# EAGLE schematic foxBMS_BMS-Slave_12cell (EAGLE 6.5.0), part 3 of 3
## Sheet 16 of 17: Ext. Power Supply
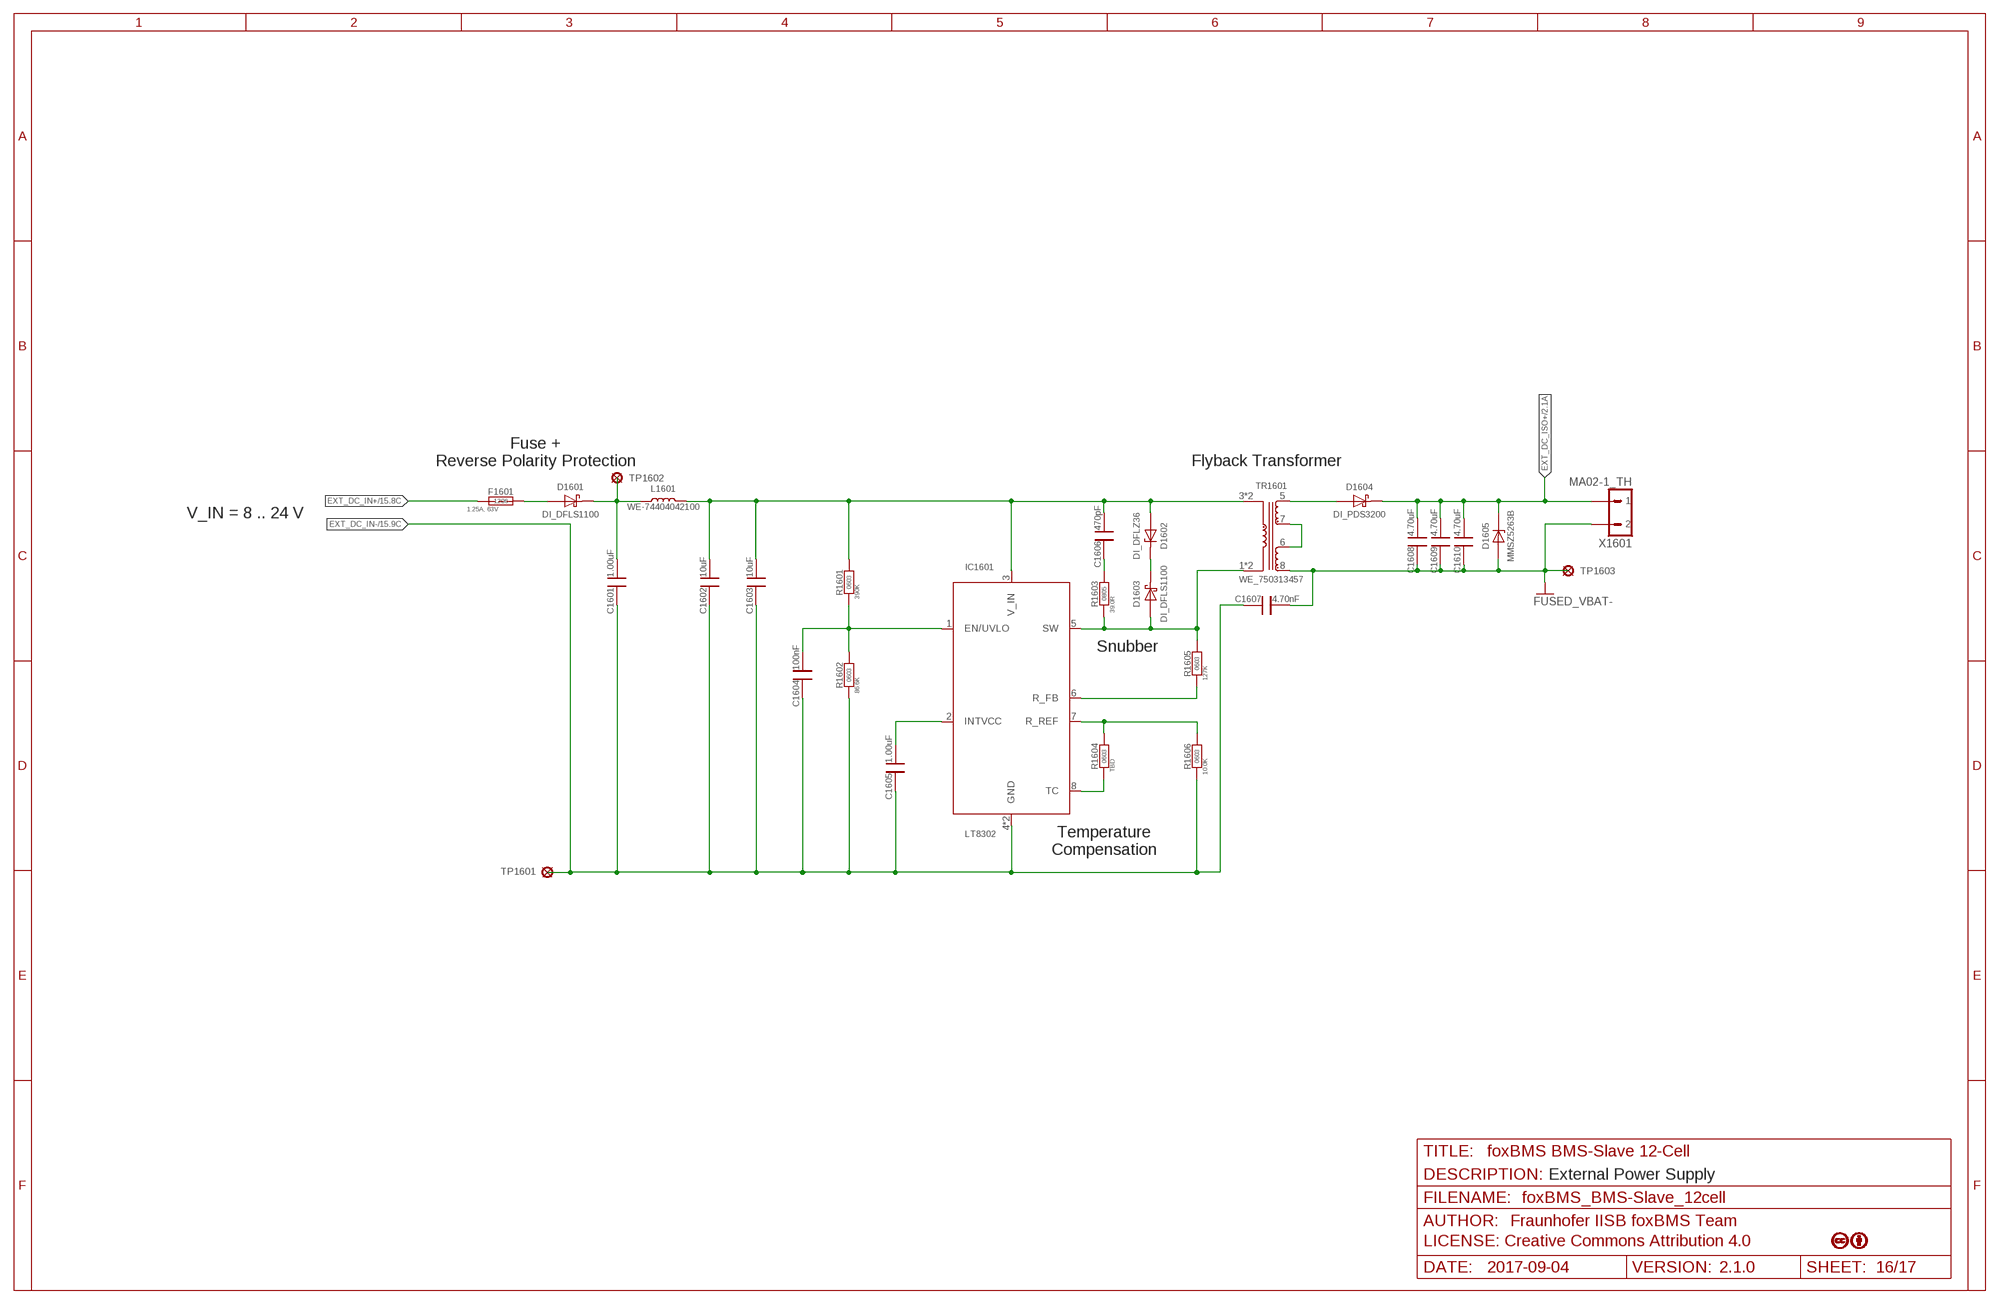
[diagram p22: schematic, sheet 16]

### Parts
C1601  1,00µF_0805_25V_X7R_KEMET  [C_SMD_0805_(2012)_R_KEMET_REV01]
C1602  10µF_1210_25V_X7R  [1210]
C1603  10µF_1210_25V_X7R  [1210]
C1604  100nF, 20%, 16V  100NF_0603_16V_X7R_KEMET  [C_SMD_0603_(1608)_R_KEMET_REV01]
C1605  1uF, 20%, 16V  1,00µF_0603_16V_X7R_KEMET  [C_SMD_0603_(1608)_R_KEMET_REV01]
C1606  470PF_0805_50V_X7R_KEMET  [C_SMD_0805_(2012)_R_KEMET_REV01]
C1607  4,7NF_1812  [1812]
C1608  4,70µF_1206_25V_X7R_KEMET  [C_SMD_1206_(3216)_R_KEMET_REV01]
C1609  4,70µF_1206_25V_X7R_KEMET  [C_SMD_1206_(3216)_R_KEMET_REV01]
C1610  4,70µF_1206_25V_X7R_KEMET  [C_SMD_1206_(3216)_R_KEMET_REV01]
D1601  DI_DFLS1100  [POWER_DI_123]
D1602  DI_DFLZ36  [POWER_DI_123]  (not fitted in variant foxBMS_Standard)  (not fitted in variant foxBMS_Debug)  (not fitted in variant foxBMS_DC-DC-only)
D1603  DI_DFLS1100  [POWER_DI_123]  (not fitted in variant foxBMS_Standard)  (not fitted in variant foxBMS_Debug)  (not fitted in variant foxBMS_DC-DC-only)
D1604  DI_PDS3200  [POWER_DI_5]
D1605  MMSZ5263B  MMSZ524CBT1  [SOD123]
F1601  1,250A_LITTELFUSE_466_1206  [R_SMD_CHIP_1206_R_LITTLEFUSE_REV_01]
IC1601  LT8302  [S8E]
L1601  WE-74404042100  [WE-LQS]
R1601  390K_0603_R_VISHAY_1%_TK100_REV_01  [R_SMD_0603_R_VISHAY_REV01]
R1602  86,6K_0603_R_VISHAY_1%_TK100_REV_01  [R_SMD_0603_R_VISHAY_REV01]
R1603  39,0R_0805_R_VISHAY_1%_TK100_REV_01  [R_SMD_0805_R_VISHAY_REV01]
R1604  DUMMY_R_CHIP_0603_R_VISHAY  [R_SMD_0603_R_VISHAY_REV01]  (not fitted in variant foxBMS_Standard)
R1605  127K_0603_R_VISHAY_1%_TK100_REV_01  [R_SMD_0603_R_VISHAY_REV01]
R1606  10,0K_0603_R_VISHAY_1%_TK100_REV_01  [R_SMD_0603_R_VISHAY_REV01]
TP1601  CUSTOM_PAD_PAD_2.0X1.5MM  [CUSTOM_PAD_PAD2.0X1.5MM]  (not fitted in variant foxBMS_Debug)  (not fitted in variant foxBMS_DC-DC-only)  (not fitted in variant foxBMS_Standard)
TP1602  CUSTOM_PAD_PAD_2.0X1.5MM  [CUSTOM_PAD_PAD2.0X1.5MM]  (not fitted in variant foxBMS_Debug)  (not fitted in variant foxBMS_DC-DC-only)  (not fitted in variant foxBMS_Standard)
TP1603  CUSTOM_PAD_PAD_2.0X1.5MM  [CUSTOM_PAD_PAD2.0X1.5MM]  (not fitted in variant foxBMS_Debug)  (not fitted in variant foxBMS_DC-DC-only)  (not fitted in variant foxBMS_Standard)
TR1601  WE_750313457  [WUERTH_CUSTOM]
X1601  MA02-1_TH  [MA02-1A]  (not fitted in variant foxBMS_Standard)  (not fitted in variant foxBMS_Debug)

### Nets
EXT_DC_IN+: F1601.P$1 ; also sheet 15
EXT_DC_IN-: C1601.P$1 C1602.P$1 C1603.P$1 C1604.1 C1605.1 C1607.P$1 IC1601.4(GND) IC1601.P$1(GND) R1602.1 R1606.1 TP1601.P$1(MP) ; also sheet 15
EXT_DC_ISO+: C1608.P$2 C1609.P$2 C1610.P$2 D1604.K(C) D1605.C(K) X1601.1 ; also sheet 2,3
FUSED_VBAT-: C1607.P$2 C1608.P$1 C1609.P$1 C1610.P$1 D1605.A TP1603.P$1(MP) TR1601.8(PIN8) X1601.2 ; also sheet 2,3,4,5,6,8,9,10,11,12,13,14,15
N$68: C1604.2 IC1601.1(EN/UVLO) R1601.1 R1602.2
N$71: C1605.2 IC1601.2(INTVCC)
N$74: TR1601.6(PIN6) TR1601.7(PIN7)
N$77: IC1601.7(R_REF) R1604.2 R1606.2
N$79: IC1601.6(R_FB) R1605.1
N$80: D1603.A IC1601.5(SW) R1603.1 R1605.2 TR1601.1(PIN2) TR1601.2(PIN2)
N$82: IC1601.8(TC) R1604.1
N$84: D1604.A1(A) D1604.A2(A) TR1601.5(PIN5)
N$87: C1606.P$1 R1603.2
N$89: D1601.A F1601.P$2
N$91: C1601.P$2 D1601.K(C) L1601.1 TP1602.P$1(MP)
N$92: D1602.K(C) D1603.K(C)
N$1254: C1602.P$2 C1603.P$2 C1606.P$2 D1602.A IC1601.3(V_IN) L1601.2 R1601.2 TR1601.3(PIN4) TR1601.4(PIN4)

### Notes on the sheet
- Fuse +
  Reverse Polarity Protection
- Flyback Transformer
- V_IN = 8 .. 24 V
- Snubber
- Temperature
  Compensation
- External Power Supply

## Sheet 17 of 17
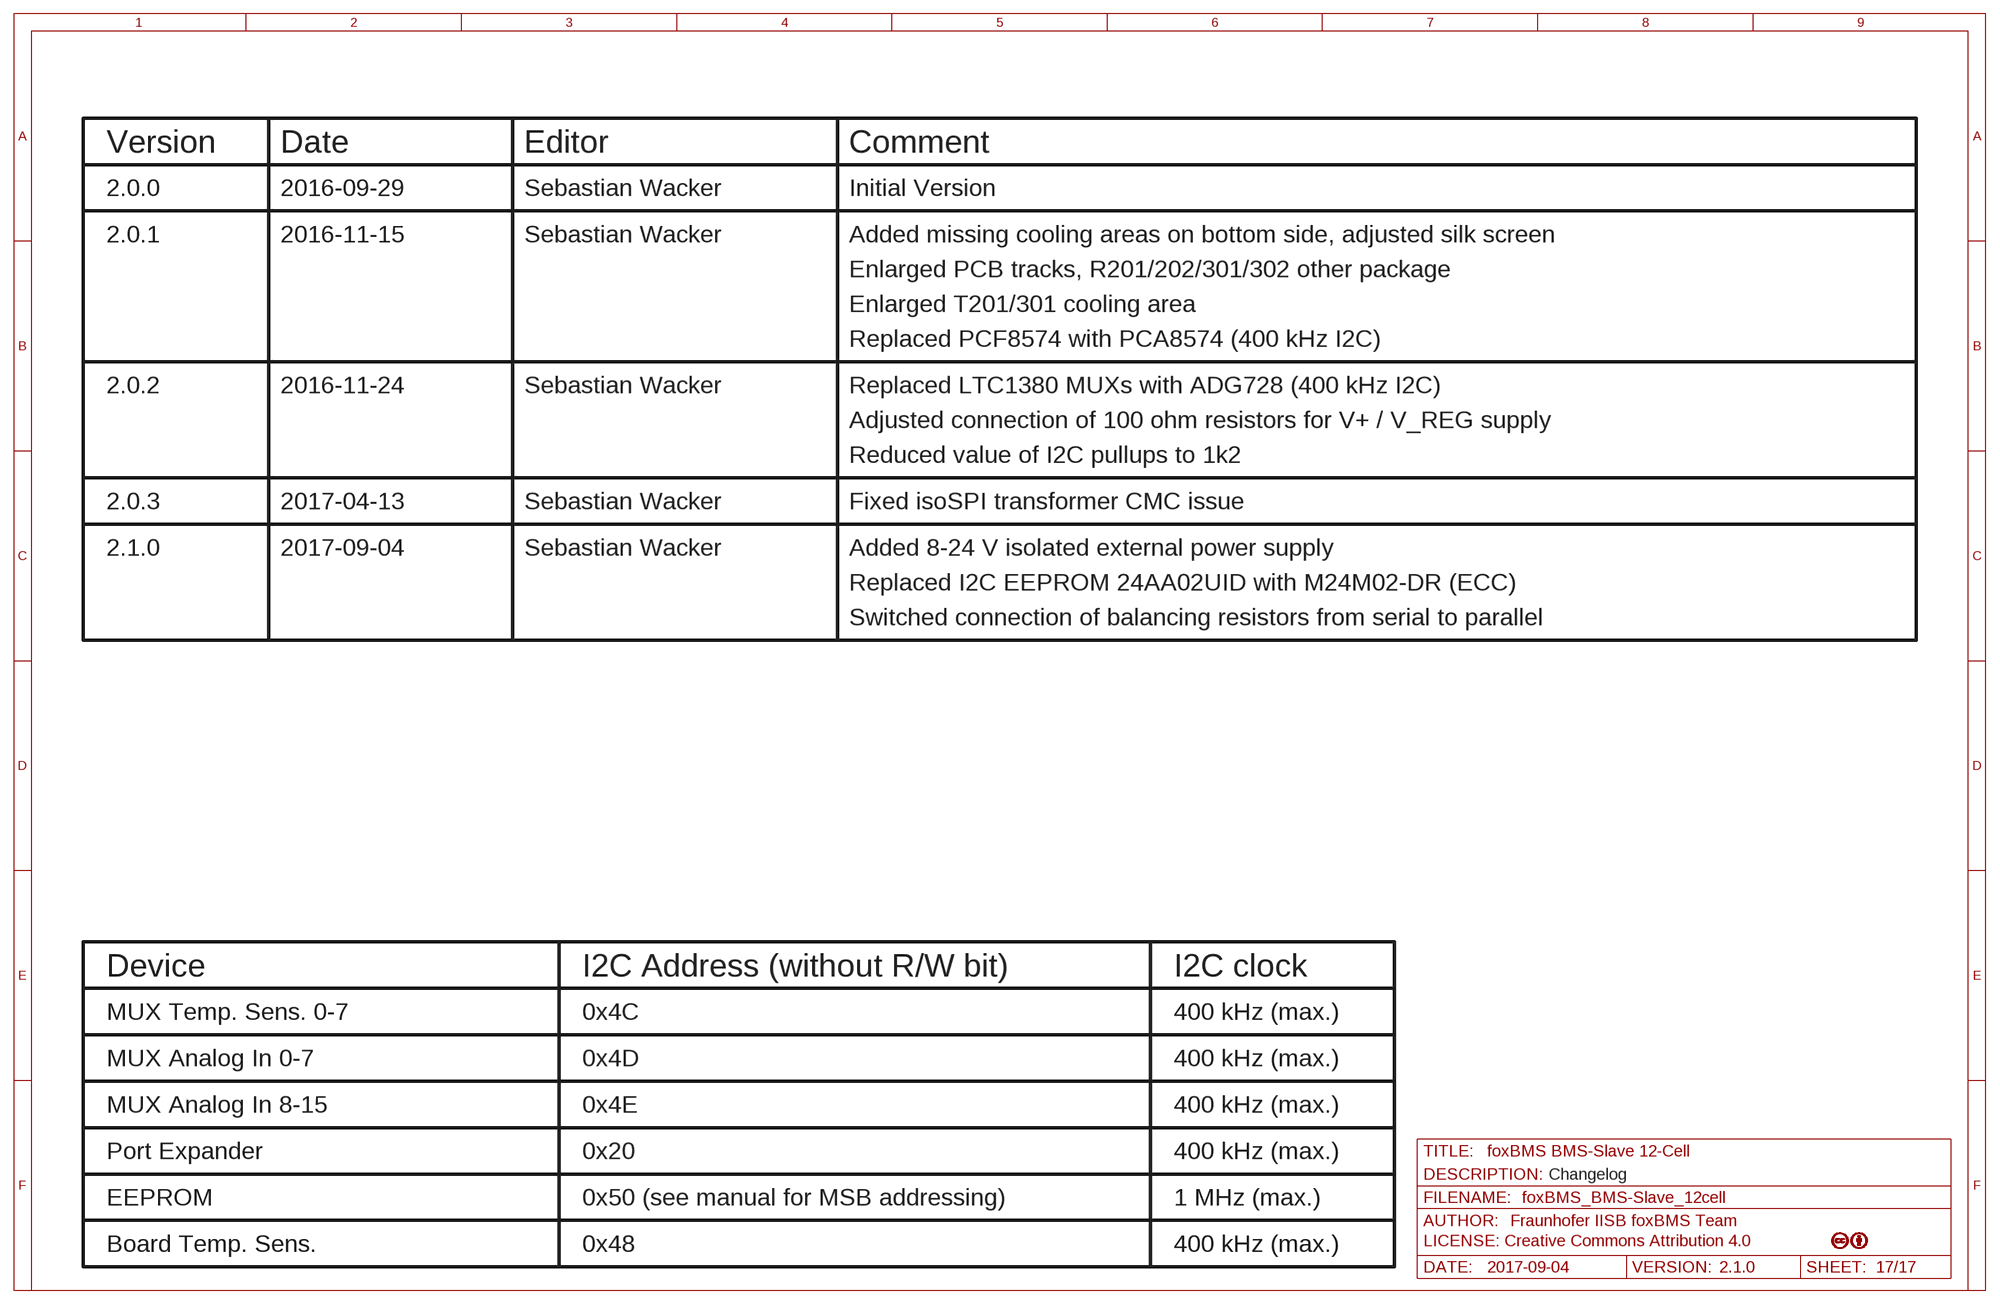
[diagram p23: schematic, sheet 17]

### Notes on the sheet
- Version | Date | Editor | Comment
- 2.0.0 | 2016-09-29 | Sebastian Wacker | Initial Version
- 2.0.1 | 2016-11-15 | Sebastian Wacker | Added missing cooling areas on bottom side, adjusted silk screen
- Enlarged PCB tracks, R201/202/301/302 other package
- Enlarged T201/301 cooling area
- Replaced PCF8574 with PCA8574 (400 kHz I2C)
- 2.0.2 | 2016-11-24 | Sebastian Wacker | Replaced LTC1380 MUXs with ADG728 (400 kHz I2C)
- Adjusted connection of 100 ohm resistors for V+ / V_REG supply
- Reduced value of I2C pullups to 1k2
- 2.0.3 | 2017-04-13 | Sebastian Wacker | Fixed isoSPI transformer CMC issue
- 2.1.0 | 2017-09-04 | Sebastian Wacker | Added 8-24 V isolated external power supply
- Replaced I2C EEPROM 24AA02UID with M24M02-DR (ECC)
- Switched connection of balancing resistors from serial to parallel
- Device | I2C Address (without R/W bit) | I2C clock
- MUX Temp. Sens. 0-7 | 0x4C | 400 kHz (max.)
- MUX Analog In 0-7 | 0x4D | 400 kHz (max.)
- MUX Analog In 8-15 | 0x4E | 400 kHz (max.)
- Port Expander | 0x20 | 400 kHz (max.)
- Changelog
- EEPROM | 0x50 (see manual for MSB addressing) | 1 MHz (max.)
- Board Temp. Sens. | 0x48 | 400 kHz (max.)

## Library data of the parts
C201 C202 C301 C302 = foxBMS_BMS-Slave_12cell:100NF?: 100nF Keramik-Kondensator KEMET-Keramikkondensator: Datasheet www <https://www.buerklin.com/datenblaetter/D104520_TD.pdf?ch=72100> Datasheet local <file:///C:\Eagle-Datasheet\Kapazitaeten\MLCC_Kemet.pdf> Multicomp-Keramikkondensator: Datasheet www <http://www.farnell.com/datasheets/1723208.pdf> Datasheet local <file:///C:\Eagle-Datasheet\Kapazitaeten\MLCC_Multicomp.pdf> MURATA-Keramikkondensator: Datasheet www <http://www.murata.com/~/media/webrenewal/support/library/catalog/products/capacitor/mlcc/c02e.ashx> Datasheet local <file:///C:\Eagle-Datasheet\Kapazitaeten\MLCC_Murata.pdf> TAIYO YUDEN-Keramikkondensator: Datasheet www <http://www.yuden.co.jp/productdata/catalog/en/mlcc01_hq_e.pdf> Datasheet local <file:///C:\Eagle-Datasheet\Kapazitaeten\MLCC_TAIYO_YUDEN.pdf> MLCC - Keramikkondensator Revision Date changed by Changes ------------------------------------------------------------------------------------------ V1.0 06.11.2014 SC Ersterstellung; DISTRI_1: Farnell; DISTRI_1-NR: 2320821; DISTRI_1-PREIS: 0,0101; HERSTELLER: MULTICOMP; HERSTELLER-NR: MC0805B104K101CT; MARKING: -; PDF-LOCAL: file:///C:\Eagle-Datasheet\Kapazitaeten\MLCC_Multicomp.pdf; SIZE: 0805; UKAT: C; UMAT: X7R; UTERM: Sn; UTK: 30PPM/°C; UTMAX: 125°C; UTMIN: -55°C; UTOL: 10%; UTYP: MLCC; UVAL: 100nF; UVDC: 100V; UVF: 0,10%
C203 C205 C206 C303 C305 C306 C902 C903 C906-C908 C1002 C1003 C1006-C1008 C1605 = foxBMS_BMS-Slave_12cell:1,00µF?: 1,00µF Keramik-Kondensator KEMET-Keramikkondensator: Datasheet www <https://www.buerklin.com/datenblaetter/D104520_TD.pdf?ch=72100> Datasheet local <file:///C:\Eagle-Datasheet\Kapazitaeten\MLCC_Kemet.pdf> Multicomp-Keramikkondensator: Datasheet www <http://www.farnell.com/datasheets/1723208.pdf> Datasheet local <file:///C:\Eagle-Datasheet\Kapazitaeten\MLCC_Multicomp.pdf> MURATA-Keramikkondensator: Datasheet www <http://www.murata.com/~/media/webrenewal/support/library/catalog/products/capacitor/mlcc/c02e.ashx> Datasheet local <file:///C:\Eagle-Datasheet\Kapazitaeten\MLCC_Murata.pdf> TAIYO YUDEN-Keramikkondensator: Datasheet www <http://www.yuden.co.jp/productdata/catalog/en/mlcc01_hq_e.pdf> Datasheet local <file:///C:\Eagle-Datasheet\Kapazitaeten\MLCC_TAIYO_YUDEN.pdf> MLCC - Keramikkondensator Revision Date changed by Changes ------------------------------------------------------------------------------------------ V1.0 06.11.2014 SC Ersterstellung; DISTRI_1: Farnell; DISTRI_1-NR: 1650837; DISTRI_1-PREIS: 0,0219 ; DISTRI_2: Mouser; DISTRI_2-NR: 80-C0603C105K4R; DISTRI_2-PREIS: 0,158; HERSTELLER: Kemet; HERSTELLER-NR: C0603C105K4R; MARKING: -; PDF-LOCAL: file:///C:\Eagle-Datasheet\Kapazitaeten\MLCC_Kemet.pdf; SIZE: 0603; UKAT: C; UMAT: X7R; UTERM: Sn; UTK: 15%; UTMAX: 125°C; UTMIN: -55°C; UTOL: 10%; UTYP: MLCC; UVAL: 1.00uF; UVDC: 16.0V; UVF: 3,5%
C204 C207 C304 C307 = foxBMS_BMS-Slave_12cell:100PF?: 100pF Keramik-Kondensator KEMET-Keramikkondensator: Datasheet www <https://www.buerklin.com/datenblaetter/D104520_TD.pdf?ch=72100> Datasheet local <file:///C:\Eagle-Datasheet\Kapazitaeten\MLCC_Kemet.pdf> Multicomp-Keramikkondensator: Datasheet www <http://www.farnell.com/datasheets/1723208.pdf> Datasheet local <file:///C:\Eagle-Datasheet\Kapazitaeten\MLCC_Multicomp.pdf> MURATA-Keramikkondensator: Datasheet www <http://www.murata.com/~/media/webrenewal/support/library/catalog/products/capacitor/mlcc/c02e.ashx> Datasheet local <file:///C:\Eagle-Datasheet\Kapazitaeten\MLCC_Murata.pdf> TAIYO YUDEN-Keramikkondensator: Datasheet www <http://www.yuden.co.jp/productdata/catalog/en/mlcc01_hq_e.pdf> Datasheet local <file:///C:\Eagle-Datasheet\Kapazitaeten\MLCC_TAIYO_YUDEN.pdf> MLCC - Keramikkondensator Revision Date changed by Changes ------------------------------------------------------------------------------------------ V1.0 06.11.2014 SC Ersterstellung; DISTRI_1: Farnell; DISTRI_1-NR: 1414603; DISTRI_1-PREIS: 0,004 ; DISTRI_2: Mouser; DISTRI_2-NR: 80-C0603C101J5G; DISTRI_2-PREIS: 0,007; HERSTELLER: Kemet; HERSTELLER-NR: C0603C101J5G; MARKING: -; PDF-LOCAL: file:///C:\Eagle-Datasheet\Kapazitaeten\MLCC_Kemet.pdf; SIZE: 0603; UKAT: C; UMAT: C0G; UTERM: Sn; UTK: 30PPM/°C; UTMAX: 125°C; UTMIN: -55°C; UTOL: 5%; UTYP: MLCC; UVAL: 100pF; UVDC: 50.0V; UVF: 0,10%
C501-C524 C601-C624 C904 C905 C1004 C1005 = foxBMS_BMS-Slave_12cell:10,0NF?: 10,0nF Keramik-Kondensator KEMET-Keramikkondensator: Datasheet www <https://www.buerklin.com/datenblaetter/D104520_TD.pdf?ch=72100> Datasheet local <file:///C:\Eagle-Datasheet\Kapazitaeten\MLCC_Kemet.pdf> Multicomp-Keramikkondensator: Datasheet www <http://www.farnell.com/datasheets/1723208.pdf> Datasheet local <file:///C:\Eagle-Datasheet\Kapazitaeten\MLCC_Multicomp.pdf> MURATA-Keramikkondensator: Datasheet www <http://www.murata.com/~/media/webrenewal/support/library/catalog/products/capacitor/mlcc/c02e.ashx> Datasheet local <file:///C:\Eagle-Datasheet\Kapazitaeten\MLCC_Murata.pdf> TAIYO YUDEN-Keramikkondensator: Datasheet www <http://www.yuden.co.jp/productdata/catalog/en/mlcc01_hq_e.pdf> Datasheet local <file:///C:\Eagle-Datasheet\Kapazitaeten\MLCC_TAIYO_YUDEN.pdf> MLCC - Keramikkondensator Revision Date changed by Changes ------------------------------------------------------------------------------------------ V1.0 06.11.2014 SC Ersterstellung; DISTRI_1: Farnell; DISTRI_1-NR: 1865545; DISTRI_1-PREIS: 0,0105; UVAL: 10.0nF
C801 C901 C1001 C1101 C1201 C1301 C1302 C1401 C1402 C1501-C1508 C1604 = foxBMS_BMS-Slave_12cell:100NF?: 100nF Keramik-Kondensator KEMET-Keramikkondensator: Datasheet www <https://www.buerklin.com/datenblaetter/D104520_TD.pdf?ch=72100> Datasheet local <file:///C:\Eagle-Datasheet\Kapazitaeten\MLCC_Kemet.pdf> Multicomp-Keramikkondensator: Datasheet www <http://www.farnell.com/datasheets/1723208.pdf> Datasheet local <file:///C:\Eagle-Datasheet\Kapazitaeten\MLCC_Multicomp.pdf> MURATA-Keramikkondensator: Datasheet www <http://www.murata.com/~/media/webrenewal/support/library/catalog/products/capacitor/mlcc/c02e.ashx> Datasheet local <file:///C:\Eagle-Datasheet\Kapazitaeten\MLCC_Murata.pdf> TAIYO YUDEN-Keramikkondensator: Datasheet www <http://www.yuden.co.jp/productdata/catalog/en/mlcc01_hq_e.pdf> Datasheet local <file:///C:\Eagle-Datasheet\Kapazitaeten\MLCC_TAIYO_YUDEN.pdf> MLCC - Keramikkondensator Revision Date changed by Changes ------------------------------------------------------------------------------------------ V1.0 06.11.2014 SC Ersterstellung; DISTRI_1: Bürklin; DISTRI_1-NR: 53D2068; DISTRI_1-PREIS: 0,03; DISTRI_2: Mouser; DISTRI_2-NR: 80-C0603C104K4R; DISTRI_2-PREIS: 0,007; HERSTELLER: Kemet; HERSTELLER-NR: C0603C104K4R; MARKING: -; PDF-LOCAL: file:///C:\Eagle-Datasheet\Kapazitaeten\MLCC_Kemet.pdf; SIZE: 0603; UKAT: C; UMAT: X7R; UTERM: Sn; UTK: 15%; UTMAX: 125°C; UTMIN: -55°C; UTOL: 10%; UTYP: MLCC; UVAL: 100nF; UVDC: 16.0V; UVF: 3,5%
C1601 = 0_LES_KAPAZITAET.SMD.MLCC:1,00µF?: 1,00µF Keramik-Kondensator KEMET-Keramikkondensator: Datasheet www <https://www.buerklin.com/datenblaetter/D104520_TD.pdf?ch=72100> Datasheet local <file:///C:\Eagle-Datasheet\Kapazitaeten\MLCC_Kemet.pdf> Multicomp-Keramikkondensator: Datasheet www <http://www.farnell.com/datasheets/1723208.pdf> Datasheet local <file:///C:\Eagle-Datasheet\Kapazitaeten\MLCC_Multicomp.pdf> MURATA-Keramikkondensator: Datasheet www <http://www.murata.com/~/media/webrenewal/support/library/catalog/products/capacitor/mlcc/c02e.ashx> Datasheet local <file:///C:\Eagle-Datasheet\Kapazitaeten\MLCC_Murata.pdf> TAIYO YUDEN-Keramikkondensator: Datasheet www <http://www.yuden.co.jp/productdata/catalog/en/mlcc01_hq_e.pdf> Datasheet local <file:///C:\Eagle-Datasheet\Kapazitaeten\MLCC_TAIYO_YUDEN.pdf> MLCC - Keramikkondensator Revision Date changed by Changes ------------------------------------------------------------------------------------------ V1.0 06.11.2014 SC Ersterstellung; DISTRI_1: Bürklin; DISTRI_1-NR: 53D2422; DISTRI_1-PREIS: 0,06€; DISTRI_2: Mouser; DISTRI_2-NR: 80-C0805C105K3R; DISTRI_2-PREIS: 0,058€; HERSTELLER: Kemet; HERSTELLER-NR: C0805C105K3R; MARKING: -; PDF-LOCAL: file:///C:\Eagle-Datasheet\Kapazitaeten\MLCC_Kemet.pdf; SIZE: 0805; UKAT: C; UMAT: X7R; UTERM: Sn; UTK: 15%; UTMAX: 125°C; UTMIN: -55°C; UTOL: 10%; UTYP: MLCC; UVAL: 1.00uF; UVDC: 25.0V; UVF: 3,5%
C1602 C1603 = 0_LES_KAPAZITAET.SMD.MLCC.KEMET:10µF?: 10µF Keramik-Kondensator Data sheet <file:///C:\Eagle-Datasheet\Kondensatoren\MLCC_Kemet.pdf> KEMET-Keramikkondensator; DISTRI_1: Bürklin; DISTRI_1-NR: 53D383; DISTRI_1-PREIS: 0,16€; DISTRI_2: Mouser; DISTRI_2-NR: 80-C1210C106K3R; DISTRI_2-PREIS: 1,16€; HERSTELLER: Kemet; HERSTELLER-NR: C1210C106K3R; TK: 15%; TOLERANCE: 10%; UPACKAGE: 1210; UTOL: X7R; UU: 25V; UVAL: 10uF; WERKSTOFF: MLCC
C1606 = 0_LES_KAPAZITAET.SMD.MLCC:470PF?: 470pF Keramik-Kondensator KEMET-Keramikkondensator: Datasheet www <https://www.buerklin.com/datenblaetter/D104520_TD.pdf?ch=72100> Datasheet local <file:///C:\Eagle-Datasheet\Kapazitaeten\MLCC_Kemet.pdf> Multicomp-Keramikkondensator: Datasheet www <http://www.farnell.com/datasheets/1723208.pdf> Datasheet local <file:///C:\Eagle-Datasheet\Kapazitaeten\MLCC_Multicomp.pdf> MURATA-Keramikkondensator: Datasheet www <http://www.murata.com/~/media/webrenewal/support/library/catalog/products/capacitor/mlcc/c02e.ashx> Datasheet local <file:///C:\Eagle-Datasheet\Kapazitaeten\MLCC_Murata.pdf> TAIYO YUDEN-Keramikkondensator: Datasheet www <http://www.yuden.co.jp/productdata/catalog/en/mlcc01_hq_e.pdf> Datasheet local <file:///C:\Eagle-Datasheet\Kapazitaeten\MLCC_TAIYO_YUDEN.pdf> MLCC - Keramikkondensator Revision Date changed by Changes ------------------------------------------------------------------------------------------ V1.0 06.11.2014 SC Ersterstellung; DISTRI_1: Bürklin; DISTRI_1-NR: 53D284; DISTRI_1-PREIS: 0,05€; DISTRI_2: Mouser; DISTRI_2-NR: 80-C0805C471K5R; DISTRI_2-PREIS: 0,016€; HERSTELLER: Kemet; HERSTELLER-NR: C0805C471K5R; MARKING: -; PDF-LOCAL: file:///C:\Eagle-Datasheet\Kapazitaeten\MLCC_Kemet.pdf; SIZE: 0805; UKAT: C; UMAT: X7R; UTERM: Sn; UTK: 15%; UTMAX: 125°C; UTMIN: -55°C; UTOL: 10%; UTYP: MLCC; UVAL: 470pF; UVDC: 50.0V; UVF: 2,5%
C1607 = 0_LES_KAPAZITAET.SMD.MLCC.KEMET_custom:4,7NF?: 4,7nF Keramik-Kondensator Data sheet <file:///C:\Eagle-Datasheet\Kondensatoren\MLCC_Kemet.pdf> KEMET-Keramikkondensator; UVAL: 4.70nF
C1608-C1610 = 0_LES_KAPAZITAET.SMD.MLCC:4,70µF?: 4,70µF Keramik-Kondensator KEMET-Keramikkondensator: Datasheet www <https://www.buerklin.com/datenblaetter/D104520_TD.pdf?ch=72100> Datasheet local <file:///C:\Eagle-Datasheet\Kapazitaeten\MLCC_Kemet.pdf> Multicomp-Keramikkondensator: Datasheet www <http://www.farnell.com/datasheets/1723208.pdf> Datasheet local <file:///C:\Eagle-Datasheet\Kapazitaeten\MLCC_Multicomp.pdf> MURATA-Keramikkondensator: Datasheet www <http://www.murata.com/~/media/webrenewal/support/library/catalog/products/capacitor/mlcc/c02e.ashx> Datasheet local <file:///C:\Eagle-Datasheet\Kapazitaeten\MLCC_Murata.pdf> TAIYO YUDEN-Keramikkondensator: Datasheet www <http://www.yuden.co.jp/productdata/catalog/en/mlcc01_hq_e.pdf> Datasheet local <file:///C:\Eagle-Datasheet\Kapazitaeten\MLCC_TAIYO_YUDEN.pdf> MLCC - Keramikkondensator Revision Date changed by Changes ------------------------------------------------------------------------------------------ V1.0 06.11.2014 SC Ersterstellung; DISTRI_1: Bürklin; DISTRI_1-NR: 53D3424; DISTRI_1-PREIS: 0,15€; DISTRI_2: Mouser; DISTRI_2-NR: 80-C1206C475K3R; DISTRI_2-PREIS: 0,125€; HERSTELLER: Kemet; HERSTELLER-NR: C1206C475K3R; MARKING: -; PDF-LOCAL: file:///C:\Eagle-Datasheet\Kapazitaeten\MLCC_Kemet.pdf; SIZE: 1210; UKAT: C; UMAT: X7R; UTERM: Sn; UTK: 15%; UTMAX: 125°C; UTMIN: -55°C; UTOL: 10%; UTYP: MLCC; UVAL: 4.70uF; UVDC: 25.0V; UVF: 3,5%
D201 D301 D1601 D1603 = diodes_custom:DI_DFLS1100: Schottky Diode
D202 D302 = foxBMS_BMS-Slave_12cell:SMAJ*CA: SMAJ bi-directional Transient Voltage Suppressors - Vishay Datasheet www <http://www.vishay.com/docs/88390/smaj50a.pdf> Datasheet local <file:///C:\Eagle-Datasheet\TVS\SMAJ_Vishay.pdf> 400 W Transient Voltage Suppressor - Ideal for automated placement - Glass passivated chip junction - Excellent clamping capability - Very fast response time - Low profile package - Low incremental surge resistance Revision Date changed by Changes ------------------------------------------------------------------------------------------ V1.0 01.04.2014 SC Ersterstellung; DISTRI_1: Farnell; DISTRI_1-NR: 1837055; DISTRI_1-PREIS: 0,112 ; HERSTELLER: Vishay; HERSTELLER-NR: SMAJ60CA-E3/61; SIZE: SMA; UTMAX: 150°C; UTMIN: -55°C; UTYP: TVS-Diode; UVAL: SMAJ60CA-E3/61; UVBR: 60V
D801 = foxBMS_BMS-Slave_12cell:BAT54C; DISTRI_1: Farnell; DISTRI_1-NR: 1081192; DISTRI_1-PREIS: (5+) 0,0323; UVAL: BAT54C
D1602 = diodes_custom:DI_DFLZ36: Schottky Diode
D1604 = diodes_custom:DI_PDS3200: Schottky Diode
D1605 = L21596_V1.0:MMSZ524CBT1: ON SEMICONDUCTOR - Zener Voltage Regulators 500 mW SOD?123 Surface Mount
F401 F415 = foxBMS_BMS-Slave_12cell:0,500A_LITTELFUSE_448; DISTRI_1: Farnell; DISTRI_1-NR: 1596919; DISTRI_1-PREIS: 0,758 ; UVAL: 500mA, 125V, 0.380R
F402-F414 = foxBMS_BMS-Slave_12cell:0,250A_LITTELFUSE_466_1206; DISTRI_1: Farnell; DISTRI_1-NR: 9921826; DISTRI_1-PREIS: 0,263 ; UPACKAGE: 1206; UVAL: 250mA, 125V, 0.691R
F1601 = foxBMS_BMS-Slave_12cell:1,250A_LITTELFUSE_466_1206; UPACKAGE: 1206; UTOL: 0.057R; UVAL: 1.25A, 63V
IC201 IC301 = foxBMS_BMS-Slave_12cell:0_LES_BATTERIE-MANAGEMENT.SMD_LTC6804*G-1: LTC6804-01 - Linear Technology Datasheet www <http://cds.linear.com/docs/en/datasheet/680412fb.pdf> Datasheet local <file:///C:\Eagle-Datasheet\Batterie-Management\LTC6804_Linear.pdf> Multicell Battery Monitors - Measures Up to 12 Battery Cells in Series - Stackable Architecture Supports 100s of Cells - Built-In isoSPI? Interface: 1Mbps Isolated Serial Communications Uses a Single Twisted Pair, Up to 100 Meters Low EMI Susceptibility and Emissions - 1.2mV Maximum Total Measurement Error - 290µs to Measure All Cells in a System - Synchronized Voltage and Current Measurement - 16-Bit Delta-Sigma ADC with Frequency Programmable 3rd Order Noise Filter - Engineered for ISO26262 Compliant Systems - Passive Cell Balancing with Programmable Timer - 5 General Purpose Digital I/O or Analog Inputs: Temperature or other Sensor Inputs Configurable as an I2C or SPI Master - 4µA Sleep Mode Supply Current - 48-Lead SSOP Package Revision Date changed by Changes ------------------------------------------------------------------------------------------ V1.0 21.04.2016 SC Ersterstellung; DISTRI_1: Digi-Key; DISTRI_1-NR: LTC6804HG-1#PBF-ND; DISTRI_1-PREIS: 18,84 ; HERSTELLER: Linear Technology; HERSTELLER-NR: LTC6804HG-1#PBF; MARKING: LTC6804G-1; PDF-LOCAL: file:///C:\Eagle-Datasheet\Batterie-Management\AN84924UA_Panasonic.pdf; SIZE: SSOP-48; UKAT: I; UTERM: Sn; UTMAX: 125°C; UTMIN: -40°C; UTYP: Battery-Management IC; UVAL: LTC6804HG-1#PBF; UVCC_MAX: 55,0V; UVCC_MIN: 11,0V
IC801-IC803 = foxBMS_BMS-Slave_12cell:ACPL-247: ACPL-247 - AVAGO Datasheet www <http://docs.avagotech.com/docs/AV02-0752EN> Datasheet local <file:///C:\Eagle-Datasheet\Signaluebertrager\ACPL-247-500E_AVAGO.pdf> DC Input Multi-Channel Half-Pitch Phototransistor Optocoupler - Current transfer ratio (CTR: 50% (min) at IF = 5mA, VCE = 5V) - High input-output isolation voltage (VISO = 3,000VRMS) - Non-saturated Response time (tr: 2µs (typ) at VCC = 10V, IC = 2mA, RL= 100Ohm) - SOIC package - CMR 10kV/µs (typical) - Safety and regulatory approvals - cUL - IEC/EN/DIN EN 60747-5-2 Revision Date changed by Changes ------------------------------------------------------------------------------------------ V1.0 05.01.2016 SC Ersterstellung; DISTRI_1: Farnell; DISTRI_1-NR: 1634758; DISTRI_1-PREIS: 0,70; DISTRI_2: Mouser; DISTRI_2-NR: 630-ACPL-247-500E; DISTRI_2-PREIS: 1,65; HERSTELLER: AVAGO Technologies; HERSTELLER-NR: ACPL-247-500E; MARKING: A247V; PDF-LOCAL: file:///C:\Eagle-Datasheet\Signaluebertrager\ACPL-247-500E_AVAGO.pdf; SIZE: SOIC-16; UIC_MAX: 50,0mA; UIC_MIN: 4,00mA; UIC_TYP: 5,00mA; UIF: 50,0mA; UKAT: I; UPV: 170mW; UTERM: Sn; UTMAX: 110°C; UTMIN: -55°C; UTRF: 2,00us; UTRR: 3,00us; UTYP: Optocoupler; UVAL: ACPL-247-500E; UVF: 1,40V; UVISO: 3,00kV; UVR: 80,0V
IC901 IC902 IC905 IC1001 IC1002 IC1005 = foxBMS_BMS-Slave_12cell:ADG728BRUZ: CMOS, Low-Voltage, 2-Wire Serially-Controlled, Matrix Switches; MPN: ADG728BRUZ; OC_FARNELL: 9604383; OC_NEWARK: 19M0691; PACKAGE: TSSOP-16; SUPPLIER: Analog Devices
IC903 IC904 IC1003 IC1004 = foxBMS_BMS-Slave_12cell:LTC6255*?: LTC6255 Serie - Linear Datasheet www <http://cds.linear.com/docs/en/datasheet/625567fd.pdf> Datasheet local <file:///C:\Eagle-Datasheet\Operationsverstaerker\LTC6255-LTC6256-LTC6257_Linear.pdf> 6.5MHz, 65µA Power Efficient Rail-to-Rail I/O Op Amps - Gain Bandwidth Product: 6.5MHz - 3dB Bandwidth (AV = +1): 4.5MHz - Low Quiescent Current: 65µA - C-Load Op Amp Drives all Capacitive Loads - Offset Voltage: 350µV Maximum - Rail-to-Rail Input and Output - Supply Voltage Range: 1.8V to 5.25V - Input Bias Current: 50nA Maximum - CMRR/PSRR: 100dB/100dB - Shutdown Current: 7µA Maximum - Operating Temperature Range: 40°C to 125°C - Single in 6-Lead TSOT-23, 2mm × 2mm DFN Packages - Dual in 8-Lead MS8, MS10, TSOT-23, 2mm × 2mm DFN, 2mm × 2mm Thin DFN Packages - Quad in MS16 Package Revision Date changed by Changes ------------------------------------------------------------------------------------------ V1.0 21.04.2016 SC Ersterstellung; DISTRI_1: Digi-Key; DISTRI_1-NR: LTC6255CS6#TRMPBFCT-ND; DISTRI_1-PREIS: 2,70; HERSTELLER: Linear Technology; HERSTELLER-NR: LTC6255CS6; MARKING: LTFFT; PDF-LOCAL: file:///C:\Eagle-Datasheet\Operationsverstaerker\LTC6255-LTC6256-LTC6257_Linear.pdf; SIZE: TSOT23-6; UBW: 6,50MHz; UKAT: I; UTERM: Sn; UTMAX: 70°C; UTMIN: 0°C; UTYP: Operational Amplifier; UVAL: LTC6255CS6; UVCC_MAX: 5,25V; UVCC_MIN: 1,80V
IC1101 IC1201 = foxBMS_BMS-Slave_12cell:PCF8574TS/3: IC, I/O EXPANDER, 8BIT, I2C, 20SSOP; DISTRI_1: Farnell; DISTRI_1-NR: 2212107; DISTRI_1-PREIS: 0,482 ; MPN: PCF8574TS/3; OC_FARNELL: 2212107; OC_NEWARK: 55W4335; PACKAGE: 20SSOP; SUPPLIER: NXP
IC1301 IC1401 = eeprom_custom:M24M02-DR: I2C EEPROM with ECC
IC1302 IC1402 = foxBMS_BMS-Slave_12cell:MCP9800A0T-M/OT: Temperature Sensor; DISTRI_1: Farnell; DISTRI_1-NR: 1439485; DISTRI_1-PREIS: 0,852; PACKAGE: SOT-5
IC1601 = linear_custom:LT8302: Flyback DC/DC Controller
L1601 = inductor_custom:WE-74404042100: Power Inductor
LD201 LD301 = foxBMS_BMS-Slave_12cell:LED: LED OSRAM: - CHIPLED LG R971, LG N971, LY N971, LG Q971, LY Q971, LO R971, LY R971 LH N974, LH R974 LS Q976, LO Q976, LY Q976 LO Q996 - Hyper CHIPLED LW Q18S LB Q993, LB Q99A, LB R99A - SideLED LS A670, LO A670, LY A670, LG A670, LP A670 LB A673, LV A673, LT A673, LW A673 LH A674 LY A675 LS A676, LA A676, LO A676, LY A676, LW A676 LS A679, LY A679, LG A679 - Hyper Micro SIDELED® LS Y876, LA Y876, LO Y876, LY Y876 LT Y87S - SmartLED LW L88C, LW L88S LB L89C, LB L89S, LG L890 LS L89K, LO L89K, LY L89K LS L896, LA L896, LO L896, LY L896 - TOPLED LS T670, LO T670, LY T670, LG T670, LP T670 LSG T670, LSP T670, LSY T670, LOP T670, LYG T670 LG T671, LOG T671, LSG T671 LB T673, LV T673, LT T673, LW T673 LH T674 LS T676, LA T676, LO T676, LY T676, LB T676, LH T676, LSB T676, LW T676 LB T67C, LV T67C, LT T67C, LS T67K, LO T67K, LY T67K, LW E67C LS E67B, LA E67B, LO E67B, LY E67B, LB E67C, LV E67C, LT E67C LW T67C LS T679, LY T679, LG T679 LS T770, LO T770, LY T770, LG T770, LP T770 LB T773, LV T773, LT T773, LW T773 LH T774 LS E675, LA E675, LY E675, LS T675 LS T776, LA T776, LO T776, LY T776, LB T776 LHGB T686 LT T68C, LB T68C - Hyper Mini TOPLED® LB M676 - Mini TOPLED Santana® LG M470 LS M47K, LO M47K, LY M47K Source: http://www.osram.convergy.de LUXEON: - LUMILED® LXK2-PW12-R00, LXK2-PW12-S00, LXK2-PW14-U00, LXK2-PW14-V00 LXK2-PM12-R00, LXK2-PM12-S00, LXK2-PM14-U00 LXK2-PE12-Q00, LXK2-PE12-R00, LXK2-PE12-S00, LXK2-PE14-T00, LXK2-PE14-U00 LXK2-PB12-K00, LXK2-PB12-L00, LXK2-PB12-M00, LXK2-PB14-N00, LXK2-PB14-P00, LXK2-PB14-Q00 LXK2-PR12-L00, LXK2-PR12-M00, LXK2-PR14-Q00, LXK2-PR14-R00 LXK2-PD12-Q00, LXK2-PD12-R00, LXK2-PD12-S00 LXK2-PH12-R00, LXK2-PH12-S00 LXK2-PL12-P00, LXK2-PL12-Q00, LXK2-PL12-R00 Source: www.luxeon.com KINGBRIGHT: KA-3528ASYC Source: www.kingbright.com; DISTRI_1: Farnell; DISTRI_1-NR: 2099223; DISTRI_1-PREIS: 0,0547 
R201 R301 = 0_LES_WIDERSTAND.SMD.CHIP.DICKSCHICHT:0,00R?*_REV_01: 0,00R SMD - CHIP - Dickschichtwiderstand Vishay D/CRCW_Vishay_Datasheet <file:///C:\Eagle-Datasheet\Widerstaende\CRCW_Vishay.pdf> Yageo/Phycomp RC0402_Datasheet <file:///C:\Eagle-Datasheet\Widerstaende\RC0402_Yageo-Phycomp.pdf>_____RL0402_Datasheet <file:///C:\Eagle-Datasheet\Widerstaende\RL0402_0603_0805_1206_1210_1218_2010_2512_Yageo-Phycomp.pdf> RC0603_Datasheet <file:///C:\Eagle-Datasheet\Widerstaende\RC0603_Yageo-Phycomp.pdf>_____RL0603_Datasheet <file:///C:\Eagle-Datasheet\Widerstaende\RL0402_0603_0805_1206_1210_1218_2010_2512_Yageo-Phycomp.pdf> RC0805_Datasheet <file:///C:\Eagle-Datasheet\Widerstaende\RC0805_Yageo-Phycomp.pdf>_____RL0805_Datasheet <file:///C:\Eagle-Datasheet\Widerstaende\RL0402_0603_0805_1206_1210_1218_2010_2512_Yageo-Phycomp.pdf> RL0805_High-Power Datasheet <file:///C:\Eagle-Datasheet\Widerstaende\RL0805_1206_High-Power_Yageo-Phycomp.pdf> RC1206_Datasheet <file:///C:\Eagle-Datasheet\Widerstaende\RC1206_Yageo-Phycomp.pdf>_____RL1206_Datasheet <file:///C:\Eagle-Datasheet\Widerstaende\RL0402_0603_0805_1206_1210_1218_2010_2512_Yageo-Phycomp.pdf> RL1206_High-Power Datasheet <file:///C:\Eagle-Datasheet\Widerstaende\RL0805_1206_High-Power_Yageo-Phycomp.pdf> RC1210_Datasheet <file:///C:\Eagle-Datasheet\Widerstaende\RC1210_Yageo-Phycomp.pdf>_____RL1210_Datasheet <file:///C:\Eagle-Datasheet\Widerstaende\RL0402_0603_0805_1206_1210_1218_2010_2512_Yageo-Phycomp.pdf> RC1218_Datasheet <file:///C:\Eagle-Datasheet\Widerstaende\RC1218_Yageo-Phycomp.pdf>_____RL1218_Datasheet <file:///C:\Eagle-Datasheet\Widerstaende\RL0402_0603_0805_1206_1210_1218_2010_2512_Yageo-Phycomp.pdf> RC2010_Datasheet <file:///C:\Eagle-Datasheet\Widerstaende\RC2010_Yageo-Phycomp.pdf>_____RL2010_Datasheet <file:///C:\Eagle-Datasheet\Widerstaende\RL0402_0603_0805_1206_1210_1218_2010_2512_Yageo-Phycomp.pdf> RC2512_Datasheet <file:///C:\Eagle-Datasheet\Widerstaende\RC2512_Yageo-Phycomp.pdf>_____RL2512_Datasheet <file:///C:\Eagle-Datasheet\Widerstaende\RL0402_0603_0805_1206_1210_1218_2010_2512_Yageo-Phycomp.pdf> RC2512_High-Power Datasheet <file:///C:\Eagle-Datasheet\Widerstaende\RC2512_High-Power_Yageo-Phycomp.pdf> Dickschichtwiderstand; DISTRI_1: Farnell; DISTRI_1-NR: 1469846; DISTRI_1-PREIS: 0,018€; DISTRI_2: Mouser; DISTRI_2-NR: 71-CRCW0805-0-E3; DISTRI_2-PREIS: 0,022€ / 100St; HERSTELLER: Vishay; HERSTELLER-NR: CRCW08050000Z0EA; MARKING: -; SIZE: 0805; UKAT: I; UMAT: Met; UPV: 125mW; URISO: >1,00GOhm; UTERM: Sn; UTK: 100PPM/°C; UTMAX: 155°C; UTMIN: -55°C; UTYP: Thickfilm; UVAL: 0.00R; UVDC: 150V; UVISO: 200V
R202 R203 R302 R303 = foxBMS_BMS-Slave_12cell:100R?*_REV_01: 100R SMD - CHIP - Dickschichtwiderstand Vishay D/CRCW_Vishay_Datasheet <file:///C:\Eagle-Datasheet\Widerstaende\CRCW_Vishay.pdf> Yageo/Phycomp RC0402_Datasheet <file:///C:\Eagle-Datasheet\Widerstaende\RC0402_Yageo-Phycomp.pdf>_____RL0402_Datasheet <file:///C:\Eagle-Datasheet\Widerstaende\RL0402_0603_0805_1206_1210_1218_2010_2512_Yageo-Phycomp.pdf> RC0603_Datasheet <file:///C:\Eagle-Datasheet\Widerstaende\RC0603_Yageo-Phycomp.pdf>_____RL0603_Datasheet <file:///C:\Eagle-Datasheet\Widerstaende\RL0402_0603_0805_1206_1210_1218_2010_2512_Yageo-Phycomp.pdf> RC0805_Datasheet <file:///C:\Eagle-Datasheet\Widerstaende\RC0805_Yageo-Phycomp.pdf>_____RL0805_Datasheet <file:///C:\Eagle-Datasheet\Widerstaende\RL0402_0603_0805_1206_1210_1218_2010_2512_Yageo-Phycomp.pdf> RL0805_High-Power Datasheet <file:///C:\Eagle-Datasheet\Widerstaende\RL0805_1206_High-Power_Yageo-Phycomp.pdf> RC1206_Datasheet <file:///C:\Eagle-Datasheet\Widerstaende\RC1206_Yageo-Phycomp.pdf>_____RL1206_Datasheet <file:///C:\Eagle-Datasheet\Widerstaende\RL0402_0603_0805_1206_1210_1218_2010_2512_Yageo-Phycomp.pdf> RL1206_High-Power Datasheet <file:///C:\Eagle-Datasheet\Widerstaende\RL0805_1206_High-Power_Yageo-Phycomp.pdf> RC1210_Datasheet <file:///C:\Eagle-Datasheet\Widerstaende\RC1210_Yageo-Phycomp.pdf>_____RL1210_Datasheet <file:///C:\Eagle-Datasheet\Widerstaende\RL0402_0603_0805_1206_1210_1218_2010_2512_Yageo-Phycomp.pdf> RC1218_Datasheet <file:///C:\Eagle-Datasheet\Widerstaende\RC1218_Yageo-Phycomp.pdf>_____RL1218_Datasheet <file:///C:\Eagle-Datasheet\Widerstaende\RL0402_0603_0805_1206_1210_1218_2010_2512_Yageo-Phycomp.pdf> RC2010_Datasheet <file:///C:\Eagle-Datasheet\Widerstaende\RC2010_Yageo-Phycomp.pdf>_____RL2010_Datasheet <file:///C:\Eagle-Datasheet\Widerstaende\RL0402_0603_0805_1206_1210_1218_2010_2512_Yageo-Phycomp.pdf> RC2512_Datasheet <file:///C:\Eagle-Datasheet\Widerstaende\RC2512_Yageo-Phycomp.pdf>_____RL2512_Datasheet <file:///C:\Eagle-Datasheet\Widerstaende\RL0402_0603_0805_1206_1210_1218_2010_2512_Yageo-Phycomp.pdf> RC2512_High-Power Datasheet <file:///C:\Eagle-Datasheet\Widerstaende\RC2512_High-Power_Yageo-Phycomp.pdf> Dickschichtwiderstand; DISTRI_1: Farnell; DISTRI_1-NR: 1469862; DISTRI_1-PREIS: 0,0242 / 100St; DISTRI_2: Mouser; DISTRI_2-NR: 71-CRCW0805-100-E3; DISTRI_2-PREIS: 0,024 / 100St; HERSTELLER: Vishay; HERSTELLER-NR: CRCW0805100RFKEA; MARKING: 1000; SIZE: 0805; UKAT: I; UMAT: Met; UPV: 125mW; URISO: >1,00GOhm; UTERM: Sn; UTK: 100PPM/°C; UTMAX: 155°C; UTMIN: -55°C; UTOL: 1%; UTYP: Thickfilm; UVAL: 100R; UVDC: 150V; UVISO: 200V
R204 R207 R304 R307 = foxBMS_BMS-Slave_12cell:120R?*_REV_01: 120R SMD - CHIP - Dickschichtwiderstand Vishay D/CRCW_Vishay_Datasheet <file:///C:\Eagle-Datasheet\Widerstaende\CRCW_Vishay.pdf> Yageo/Phycomp RC0402_Datasheet <file:///C:\Eagle-Datasheet\Widerstaende\RC0402_Yageo-Phycomp.pdf>_____RL0402_Datasheet <file:///C:\Eagle-Datasheet\Widerstaende\RL0402_0603_0805_1206_1210_1218_2010_2512_Yageo-Phycomp.pdf> RC0603_Datasheet <file:///C:\Eagle-Datasheet\Widerstaende\RC0603_Yageo-Phycomp.pdf>_____RL0603_Datasheet <file:///C:\Eagle-Datasheet\Widerstaende\RL0402_0603_0805_1206_1210_1218_2010_2512_Yageo-Phycomp.pdf> RC0805_Datasheet <file:///C:\Eagle-Datasheet\Widerstaende\RC0805_Yageo-Phycomp.pdf>_____RL0805_Datasheet <file:///C:\Eagle-Datasheet\Widerstaende\RL0402_0603_0805_1206_1210_1218_2010_2512_Yageo-Phycomp.pdf> RL0805_High-Power Datasheet <file:///C:\Eagle-Datasheet\Widerstaende\RL0805_1206_High-Power_Yageo-Phycomp.pdf> RC1206_Datasheet <file:///C:\Eagle-Datasheet\Widerstaende\RC1206_Yageo-Phycomp.pdf>_____RL1206_Datasheet <file:///C:\Eagle-Datasheet\Widerstaende\RL0402_0603_0805_1206_1210_1218_2010_2512_Yageo-Phycomp.pdf> RL1206_High-Power Datasheet <file:///C:\Eagle-Datasheet\Widerstaende\RL0805_1206_High-Power_Yageo-Phycomp.pdf> RC1210_Datasheet <file:///C:\Eagle-Datasheet\Widerstaende\RC1210_Yageo-Phycomp.pdf>_____RL1210_Datasheet <file:///C:\Eagle-Datasheet\Widerstaende\RL0402_0603_0805_1206_1210_1218_2010_2512_Yageo-Phycomp.pdf> RC1218_Datasheet <file:///C:\Eagle-Datasheet\Widerstaende\RC1218_Yageo-Phycomp.pdf>_____RL1218_Datasheet <file:///C:\Eagle-Datasheet\Widerstaende\RL0402_0603_0805_1206_1210_1218_2010_2512_Yageo-Phycomp.pdf> RC2010_Datasheet <file:///C:\Eagle-Datasheet\Widerstaende\RC2010_Yageo-Phycomp.pdf>_____RL2010_Datasheet <file:///C:\Eagle-Datasheet\Widerstaende\RL0402_0603_0805_1206_1210_1218_2010_2512_Yageo-Phycomp.pdf> RC2512_Datasheet <file:///C:\Eagle-Datasheet\Widerstaende\RC2512_Yageo-Phycomp.pdf>_____RL2512_Datasheet <file:///C:\Eagle-Datasheet\Widerstaende\RL0402_0603_0805_1206_1210_1218_2010_2512_Yageo-Phycomp.pdf> RC2512_High-Power Datasheet <file:///C:\Eagle-Datasheet\Widerstaende\RC2512_High-Power_Yageo-Phycomp.pdf> Dickschichtwiderstand; DISTRI_1: Farnell; DISTRI_1-NR: 1652832; DISTRI_1-PREIS: 0,013 / 100St; DISTRI_2: Mouser; DISTRI_2-NR: 71-CRCW0603-120-E3; DISTRI_2-PREIS: 0,009 / 100St; HERSTELLER: Vishay; HERSTELLER-NR: CRCW0603120RFKEA; MARKING: 1200; SIZE: 0603; UKAT: I; UMAT: Met; UPV: 100mW; URISO: >1,00GOhm; UTERM: Sn; UTK: 100PPM/°C; UTMAX: 155°C; UTMIN: -55°C; UTOL: 1%; UTYP: Thickfilm; UVAL: 120R; UVDC: 75,0V; UVISO: 100V
R205 R305 = 0_LES_WIDERSTAND.SMD.CHIP.DICKSCHICHT:330R?*_REV_01: 330R SMD - CHIP - Dickschichtwiderstand Vishay D/CRCW_Vishay_Datasheet <file:///C:\Eagle-Datasheet\Widerstaende\CRCW_Vishay.pdf> Yageo/Phycomp RC0402_Datasheet <file:///C:\Eagle-Datasheet\Widerstaende\RC0402_Yageo-Phycomp.pdf>_____RL0402_Datasheet <file:///C:\Eagle-Datasheet\Widerstaende\RL0402_0603_0805_1206_1210_1218_2010_2512_Yageo-Phycomp.pdf> RC0603_Datasheet <file:///C:\Eagle-Datasheet\Widerstaende\RC0603_Yageo-Phycomp.pdf>_____RL0603_Datasheet <file:///C:\Eagle-Datasheet\Widerstaende\RL0402_0603_0805_1206_1210_1218_2010_2512_Yageo-Phycomp.pdf> RC0805_Datasheet <file:///C:\Eagle-Datasheet\Widerstaende\RC0805_Yageo-Phycomp.pdf>_____RL0805_Datasheet <file:///C:\Eagle-Datasheet\Widerstaende\RL0402_0603_0805_1206_1210_1218_2010_2512_Yageo-Phycomp.pdf> RL0805_High-Power Datasheet <file:///C:\Eagle-Datasheet\Widerstaende\RL0805_1206_High-Power_Yageo-Phycomp.pdf> RC1206_Datasheet <file:///C:\Eagle-Datasheet\Widerstaende\RC1206_Yageo-Phycomp.pdf>_____RL1206_Datasheet <file:///C:\Eagle-Datasheet\Widerstaende\RL0402_0603_0805_1206_1210_1218_2010_2512_Yageo-Phycomp.pdf> RL1206_High-Power Datasheet <file:///C:\Eagle-Datasheet\Widerstaende\RL0805_1206_High-Power_Yageo-Phycomp.pdf> RC1210_Datasheet <file:///C:\Eagle-Datasheet\Widerstaende\RC1210_Yageo-Phycomp.pdf>_____RL1210_Datasheet <file:///C:\Eagle-Datasheet\Widerstaende\RL0402_0603_0805_1206_1210_1218_2010_2512_Yageo-Phycomp.pdf> RC1218_Datasheet <file:///C:\Eagle-Datasheet\Widerstaende\RC1218_Yageo-Phycomp.pdf>_____RL1218_Datasheet <file:///C:\Eagle-Datasheet\Widerstaende\RL0402_0603_0805_1206_1210_1218_2010_2512_Yageo-Phycomp.pdf> RC2010_Datasheet <file:///C:\Eagle-Datasheet\Widerstaende\RC2010_Yageo-Phycomp.pdf>_____RL2010_Datasheet <file:///C:\Eagle-Datasheet\Widerstaende\RL0402_0603_0805_1206_1210_1218_2010_2512_Yageo-Phycomp.pdf> RC2512_Datasheet <file:///C:\Eagle-Datasheet\Widerstaende\RC2512_Yageo-Phycomp.pdf>_____RL2512_Datasheet <file:///C:\Eagle-Datasheet\Widerstaende\RL0402_0603_0805_1206_1210_1218_2010_2512_Yageo-Phycomp.pdf> RC2512_High-Power Datasheet <file:///C:\Eagle-Datasheet\Widerstaende\RC2512_High-Power_Yageo-Phycomp.pdf> Dickschichtwiderstand; DISTRI_1: Farnell; DISTRI_1-NR: 1469803; DISTRI_1-PREIS: 0,0116€ / 100St; DISTRI_2: Mouser; DISTRI_2-NR: 71-CRCW0603-330-E3; DISTRI_2-PREIS: 0,009€ / 100St; HERSTELLER: Vishay; HERSTELLER-NR: CRCW0603330RFKEA; MARKING: 3300; SIZE: 0603; UKAT: I; UMAT: Met; UPV: 100mW; URISO: >1,00GOhm; UTERM: Sn; UTK: 100PPM/°C; UTMAX: 155°C; UTMIN: -55°C; UTOL: 1%; UTYP: Thickfilm; UVAL: 330R; UVDC: 75,0V; UVISO: 100V
R206 R306 = foxBMS_BMS-Slave_12cell:820R?*_REV_01: 820R SMD - CHIP - Dickschichtwiderstand Vishay D/CRCW_Vishay_Datasheet <file:///C:\Eagle-Datasheet\Widerstaende\CRCW_Vishay.pdf> Yageo/Phycomp RC0402_Datasheet <file:///C:\Eagle-Datasheet\Widerstaende\RC0402_Yageo-Phycomp.pdf>_____RL0402_Datasheet <file:///C:\Eagle-Datasheet\Widerstaende\RL0402_0603_0805_1206_1210_1218_2010_2512_Yageo-Phycomp.pdf> RC0603_Datasheet <file:///C:\Eagle-Datasheet\Widerstaende\RC0603_Yageo-Phycomp.pdf>_____RL0603_Datasheet <file:///C:\Eagle-Datasheet\Widerstaende\RL0402_0603_0805_1206_1210_1218_2010_2512_Yageo-Phycomp.pdf> RC0805_Datasheet <file:///C:\Eagle-Datasheet\Widerstaende\RC0805_Yageo-Phycomp.pdf>_____RL0805_Datasheet <file:///C:\Eagle-Datasheet\Widerstaende\RL0402_0603_0805_1206_1210_1218_2010_2512_Yageo-Phycomp.pdf> RL0805_High-Power Datasheet <file:///C:\Eagle-Datasheet\Widerstaende\RL0805_1206_High-Power_Yageo-Phycomp.pdf> RC1206_Datasheet <file:///C:\Eagle-Datasheet\Widerstaende\RC1206_Yageo-Phycomp.pdf>_____RL1206_Datasheet <file:///C:\Eagle-Datasheet\Widerstaende\RL0402_0603_0805_1206_1210_1218_2010_2512_Yageo-Phycomp.pdf> RL1206_High-Power Datasheet <file:///C:\Eagle-Datasheet\Widerstaende\RL0805_1206_High-Power_Yageo-Phycomp.pdf> RC1210_Datasheet <file:///C:\Eagle-Datasheet\Widerstaende\RC1210_Yageo-Phycomp.pdf>_____RL1210_Datasheet <file:///C:\Eagle-Datasheet\Widerstaende\RL0402_0603_0805_1206_1210_1218_2010_2512_Yageo-Phycomp.pdf> RC1218_Datasheet <file:///C:\Eagle-Datasheet\Widerstaende\RC1218_Yageo-Phycomp.pdf>_____RL1218_Datasheet <file:///C:\Eagle-Datasheet\Widerstaende\RL0402_0603_0805_1206_1210_1218_2010_2512_Yageo-Phycomp.pdf> RC2010_Datasheet <file:///C:\Eagle-Datasheet\Widerstaende\RC2010_Yageo-Phycomp.pdf>_____RL2010_Datasheet <file:///C:\Eagle-Datasheet\Widerstaende\RL0402_0603_0805_1206_1210_1218_2010_2512_Yageo-Phycomp.pdf> RC2512_Datasheet <file:///C:\Eagle-Datasheet\Widerstaende\RC2512_Yageo-Phycomp.pdf>_____RL2512_Datasheet <file:///C:\Eagle-Datasheet\Widerstaende\RL0402_0603_0805_1206_1210_1218_2010_2512_Yageo-Phycomp.pdf> RC2512_High-Power Datasheet <file:///C:\Eagle-Datasheet\Widerstaende\RC2512_High-Power_Yageo-Phycomp.pdf> Dickschichtwiderstand; DISTRI_1: Farnell; DISTRI_1-NR: 1469841; DISTRI_1-PREIS: 0,0095 / 100St; DISTRI_2: Mouser; DISTRI_2-NR: 71-CRCW0603-820-E3; DISTRI_2-PREIS: 0,024 / 100St; HERSTELLER: Vishay; HERSTELLER-NR: CRCW0603820RFKEA; MARKING: 8200; SIZE: 0603; UKAT: I; UMAT: Met; UPV: 100mW; URISO: >1,00GOhm; UTERM: Sn; UTK: 100PPM/°C; UTMAX: 155°C; UTMIN: -55°C; UTOL: 1%; UTYP: Thickfilm; UVAL: 820R; UVDC: 75,0V; UVISO: 100V
R208 R308 = foxBMS_BMS-Slave_12cell:1,21K?*_REV_01: 1,21K SMD - CHIP - Dickschichtwiderstand Vishay D/CRCW_Vishay_Datasheet <file:///C:\Eagle-Datasheet\Widerstaende\CRCW_Vishay.pdf> Yageo/Phycomp RC0402_Datasheet <file:///C:\Eagle-Datasheet\Widerstaende\RC0402_Yageo-Phycomp.pdf>_____RL0402_Datasheet <file:///C:\Eagle-Datasheet\Widerstaende\RL0402_0603_0805_1206_1210_1218_2010_2512_Yageo-Phycomp.pdf> RC0603_Datasheet <file:///C:\Eagle-Datasheet\Widerstaende\RC0603_Yageo-Phycomp.pdf>_____RL0603_Datasheet <file:///C:\Eagle-Datasheet\Widerstaende\RL0402_0603_0805_1206_1210_1218_2010_2512_Yageo-Phycomp.pdf> RC0805_Datasheet <file:///C:\Eagle-Datasheet\Widerstaende\RC0805_Yageo-Phycomp.pdf>_____RL0805_Datasheet <file:///C:\Eagle-Datasheet\Widerstaende\RL0402_0603_0805_1206_1210_1218_2010_2512_Yageo-Phycomp.pdf> RL0805_High-Power Datasheet <file:///C:\Eagle-Datasheet\Widerstaende\RL0805_1206_High-Power_Yageo-Phycomp.pdf> RC1206_Datasheet <file:///C:\Eagle-Datasheet\Widerstaende\RC1206_Yageo-Phycomp.pdf>_____RL1206_Datasheet <file:///C:\Eagle-Datasheet\Widerstaende\RL0402_0603_0805_1206_1210_1218_2010_2512_Yageo-Phycomp.pdf> RL1206_High-Power Datasheet <file:///C:\Eagle-Datasheet\Widerstaende\RL0805_1206_High-Power_Yageo-Phycomp.pdf> RC1210_Datasheet <file:///C:\Eagle-Datasheet\Widerstaende\RC1210_Yageo-Phycomp.pdf>_____RL1210_Datasheet <file:///C:\Eagle-Datasheet\Widerstaende\RL0402_0603_0805_1206_1210_1218_2010_2512_Yageo-Phycomp.pdf> RC1218_Datasheet <file:///C:\Eagle-Datasheet\Widerstaende\RC1218_Yageo-Phycomp.pdf>_____RL1218_Datasheet <file:///C:\Eagle-Datasheet\Widerstaende\RL0402_0603_0805_1206_1210_1218_2010_2512_Yageo-Phycomp.pdf> RC2010_Datasheet <file:///C:\Eagle-Datasheet\Widerstaende\RC2010_Yageo-Phycomp.pdf>_____RL2010_Datasheet <file:///C:\Eagle-Datasheet\Widerstaende\RL0402_0603_0805_1206_1210_1218_2010_2512_Yageo-Phycomp.pdf> RC2512_Datasheet <file:///C:\Eagle-Datasheet\Widerstaende\RC2512_Yageo-Phycomp.pdf>_____RL2512_Datasheet <file:///C:\Eagle-Datasheet\Widerstaende\RL0402_0603_0805_1206_1210_1218_2010_2512_Yageo-Phycomp.pdf> RC2512_High-Power Datasheet <file:///C:\Eagle-Datasheet\Widerstaende\RC2512_High-Power_Yageo-Phycomp.pdf> Dickschichtwiderstand; DISTRI_1: Farnell; DISTRI_1-NR: 1652852; DISTRI_1-PREIS: 0,028; DISTRI_2: Mouser; DISTRI_2-NR: 71-CRCW0603-1.21K-E3; DISTRI_2-PREIS: 0,011 / 100St; HERSTELLER: Vishay; HERSTELLER-NR: CRCW06031K21FKEA; MARKING: 1211; SIZE: 0603; UKAT: I; UMAT: Met; UPV: 100mW; URISO: >1,00GOhm; UTERM: Sn; UTK: 100PPM/°C; UTMAX: 155°C; UTMIN: -55°C; UTOL: 1%; UTYP: Thickfilm; UVAL: 1.21K; UVDC: 75,0V; UVISO: 100V
R209-R218 R220 R221 R309-R318 R320 R321 = foxBMS_BMS-Slave_12cell:0,00R?*_REV_01: 0,00R SMD - CHIP - Dickschichtwiderstand Vishay D/CRCW_Vishay_Datasheet <file:///C:\Eagle-Datasheet\Widerstaende\CRCW_Vishay.pdf> Yageo/Phycomp RC0402_Datasheet <file:///C:\Eagle-Datasheet\Widerstaende\RC0402_Yageo-Phycomp.pdf>_____RL0402_Datasheet <file:///C:\Eagle-Datasheet\Widerstaende\RL0402_0603_0805_1206_1210_1218_2010_2512_Yageo-Phycomp.pdf> RC0603_Datasheet <file:///C:\Eagle-Datasheet\Widerstaende\RC0603_Yageo-Phycomp.pdf>_____RL0603_Datasheet <file:///C:\Eagle-Datasheet\Widerstaende\RL0402_0603_0805_1206_1210_1218_2010_2512_Yageo-Phycomp.pdf> RC0805_Datasheet <file:///C:\Eagle-Datasheet\Widerstaende\RC0805_Yageo-Phycomp.pdf>_____RL0805_Datasheet <file:///C:\Eagle-Datasheet\Widerstaende\RL0402_0603_0805_1206_1210_1218_2010_2512_Yageo-Phycomp.pdf> RL0805_High-Power Datasheet <file:///C:\Eagle-Datasheet\Widerstaende\RL0805_1206_High-Power_Yageo-Phycomp.pdf> RC1206_Datasheet <file:///C:\Eagle-Datasheet\Widerstaende\RC1206_Yageo-Phycomp.pdf>_____RL1206_Datasheet <file:///C:\Eagle-Datasheet\Widerstaende\RL0402_0603_0805_1206_1210_1218_2010_2512_Yageo-Phycomp.pdf> RL1206_High-Power Datasheet <file:///C:\Eagle-Datasheet\Widerstaende\RL0805_1206_High-Power_Yageo-Phycomp.pdf> RC1210_Datasheet <file:///C:\Eagle-Datasheet\Widerstaende\RC1210_Yageo-Phycomp.pdf>_____RL1210_Datasheet <file:///C:\Eagle-Datasheet\Widerstaende\RL0402_0603_0805_1206_1210_1218_2010_2512_Yageo-Phycomp.pdf> RC1218_Datasheet <file:///C:\Eagle-Datasheet\Widerstaende\RC1218_Yageo-Phycomp.pdf>_____RL1218_Datasheet <file:///C:\Eagle-Datasheet\Widerstaende\RL0402_0603_0805_1206_1210_1218_2010_2512_Yageo-Phycomp.pdf> RC2010_Datasheet <file:///C:\Eagle-Datasheet\Widerstaende\RC2010_Yageo-Phycomp.pdf>_____RL2010_Datasheet <file:///C:\Eagle-Datasheet\Widerstaende\RL0402_0603_0805_1206_1210_1218_2010_2512_Yageo-Phycomp.pdf> RC2512_Datasheet <file:///C:\Eagle-Datasheet\Widerstaende\RC2512_Yageo-Phycomp.pdf>_____RL2512_Datasheet <file:///C:\Eagle-Datasheet\Widerstaende\RL0402_0603_0805_1206_1210_1218_2010_2512_Yageo-Phycomp.pdf> RC2512_High-Power Datasheet <file:///C:\Eagle-Datasheet\Widerstaende\RC2512_High-Power_Yageo-Phycomp.pdf> Dickschichtwiderstand; DISTRI_1: Farnell; DISTRI_1-NR: 1469739; DISTRI_1-PREIS: 0,019; DISTRI_2: Mouser; DISTRI_2-NR: 71-CRCW0603-0-E3; DISTRI_2-PREIS: 0,007 / 100St; HERSTELLER: Vishay; HERSTELLER-NR: CRCW06030000Z0EA; MARKING: -; SIZE: 0603; UKAT: I; UMAT: Met; UPV: 100mW; URISO: >1,00GOhm; UTERM: Sn; UTK: 100PPM/°C; UTMAX: 155°C; UTMIN: -55°C; UTYP: Thickfilm; UVAL: 0.00R; UVDC: 75,0V; UVISO: 100V
R219 R319 = foxBMS_BMS-Slave_12cell:1,00M?*_REV_01: 1,00M SMD - CHIP - Dickschichtwiderstand Vishay D/CRCW_Vishay_Datasheet <file:///C:\Eagle-Datasheet\Widerstaende\CRCW_Vishay.pdf> Yageo/Phycomp RC0402_Datasheet <file:///C:\Eagle-Datasheet\Widerstaende\RC0402_Yageo-Phycomp.pdf>_____RL0402_Datasheet <file:///C:\Eagle-Datasheet\Widerstaende\RL0402_0603_0805_1206_1210_1218_2010_2512_Yageo-Phycomp.pdf> RC0603_Datasheet <file:///C:\Eagle-Datasheet\Widerstaende\RC0603_Yageo-Phycomp.pdf>_____RL0603_Datasheet <file:///C:\Eagle-Datasheet\Widerstaende\RL0402_0603_0805_1206_1210_1218_2010_2512_Yageo-Phycomp.pdf> RC0805_Datasheet <file:///C:\Eagle-Datasheet\Widerstaende\RC0805_Yageo-Phycomp.pdf>_____RL0805_Datasheet <file:///C:\Eagle-Datasheet\Widerstaende\RL0402_0603_0805_1206_1210_1218_2010_2512_Yageo-Phycomp.pdf> RL0805_High-Power Datasheet <file:///C:\Eagle-Datasheet\Widerstaende\RL0805_1206_High-Power_Yageo-Phycomp.pdf> RC1206_Datasheet <file:///C:\Eagle-Datasheet\Widerstaende\RC1206_Yageo-Phycomp.pdf>_____RL1206_Datasheet <file:///C:\Eagle-Datasheet\Widerstaende\RL0402_0603_0805_1206_1210_1218_2010_2512_Yageo-Phycomp.pdf> RL1206_High-Power Datasheet <file:///C:\Eagle-Datasheet\Widerstaende\RL0805_1206_High-Power_Yageo-Phycomp.pdf> RC1210_Datasheet <file:///C:\Eagle-Datasheet\Widerstaende\RC1210_Yageo-Phycomp.pdf>_____RL1210_Datasheet <file:///C:\Eagle-Datasheet\Widerstaende\RL0402_0603_0805_1206_1210_1218_2010_2512_Yageo-Phycomp.pdf> RC1218_Datasheet <file:///C:\Eagle-Datasheet\Widerstaende\RC1218_Yageo-Phycomp.pdf>_____RL1218_Datasheet <file:///C:\Eagle-Datasheet\Widerstaende\RL0402_0603_0805_1206_1210_1218_2010_2512_Yageo-Phycomp.pdf> RC2010_Datasheet <file:///C:\Eagle-Datasheet\Widerstaende\RC2010_Yageo-Phycomp.pdf>_____RL2010_Datasheet <file:///C:\Eagle-Datasheet\Widerstaende\RL0402_0603_0805_1206_1210_1218_2010_2512_Yageo-Phycomp.pdf> RC2512_Datasheet <file:///C:\Eagle-Datasheet\Widerstaende\RC2512_Yageo-Phycomp.pdf>_____RL2512_Datasheet <file:///C:\Eagle-Datasheet\Widerstaende\RL0402_0603_0805_1206_1210_1218_2010_2512_Yageo-Phycomp.pdf> RC2512_High-Power Datasheet <file:///C:\Eagle-Datasheet\Widerstaende\RC2512_High-Power_Yageo-Phycomp.pdf> Dickschichtwiderstand; DISTRI_1: Farnell; DISTRI_1-NR: 1469746; DISTRI_1-PREIS: 0,019; DISTRI_2: Mouser; DISTRI_2-NR: 71-CRCW0603-1.0M-E3; DISTRI_2-PREIS: 0,008 / 100St; HERSTELLER: Vishay; HERSTELLER-NR: CRCW06031M00FKEA; MARKING: 1004; SIZE: 0603; UKAT: I; UMAT: Met; UPV: 100mW; URISO: >1,00GOhm; UTERM: Sn; UTK: 100PPM/°C; UTMAX: 155°C; UTMIN: -55°C; UTOL: 1%; UTYP: Thickfilm; UVAL: 1.00M; UVDC: 75,0V; UVISO: 100V
R222 R223 R322 R323 = foxBMS_BMS-Slave_12cell:1,20K?*_REV_01: 1,20K SMD - CHIP - Dickschichtwiderstand Vishay D/CRCW_Vishay_Datasheet <file:///C:\Eagle-Datasheet\Widerstaende\CRCW_Vishay.pdf> Yageo/Phycomp RC0402_Datasheet <file:///C:\Eagle-Datasheet\Widerstaende\RC0402_Yageo-Phycomp.pdf>_____RL0402_Datasheet <file:///C:\Eagle-Datasheet\Widerstaende\RL0402_0603_0805_1206_1210_1218_2010_2512_Yageo-Phycomp.pdf> RC0603_Datasheet <file:///C:\Eagle-Datasheet\Widerstaende\RC0603_Yageo-Phycomp.pdf>_____RL0603_Datasheet <file:///C:\Eagle-Datasheet\Widerstaende\RL0402_0603_0805_1206_1210_1218_2010_2512_Yageo-Phycomp.pdf> RC0805_Datasheet <file:///C:\Eagle-Datasheet\Widerstaende\RC0805_Yageo-Phycomp.pdf>_____RL0805_Datasheet <file:///C:\Eagle-Datasheet\Widerstaende\RL0402_0603_0805_1206_1210_1218_2010_2512_Yageo-Phycomp.pdf> RL0805_High-Power Datasheet <file:///C:\Eagle-Datasheet\Widerstaende\RL0805_1206_High-Power_Yageo-Phycomp.pdf> RC1206_Datasheet <file:///C:\Eagle-Datasheet\Widerstaende\RC1206_Yageo-Phycomp.pdf>_____RL1206_Datasheet <file:///C:\Eagle-Datasheet\Widerstaende\RL0402_0603_0805_1206_1210_1218_2010_2512_Yageo-Phycomp.pdf> RL1206_High-Power Datasheet <file:///C:\Eagle-Datasheet\Widerstaende\RL0805_1206_High-Power_Yageo-Phycomp.pdf> RC1210_Datasheet <file:///C:\Eagle-Datasheet\Widerstaende\RC1210_Yageo-Phycomp.pdf>_____RL1210_Datasheet <file:///C:\Eagle-Datasheet\Widerstaende\RL0402_0603_0805_1206_1210_1218_2010_2512_Yageo-Phycomp.pdf> RC1218_Datasheet <file:///C:\Eagle-Datasheet\Widerstaende\RC1218_Yageo-Phycomp.pdf>_____RL1218_Datasheet <file:///C:\Eagle-Datasheet\Widerstaende\RL0402_0603_0805_1206_1210_1218_2010_2512_Yageo-Phycomp.pdf> RC2010_Datasheet <file:///C:\Eagle-Datasheet\Widerstaende\RC2010_Yageo-Phycomp.pdf>_____RL2010_Datasheet <file:///C:\Eagle-Datasheet\Widerstaende\RL0402_0603_0805_1206_1210_1218_2010_2512_Yageo-Phycomp.pdf> RC2512_Datasheet <file:///C:\Eagle-Datasheet\Widerstaende\RC2512_Yageo-Phycomp.pdf>_____RL2512_Datasheet <file:///C:\Eagle-Datasheet\Widerstaende\RL0402_0603_0805_1206_1210_1218_2010_2512_Yageo-Phycomp.pdf> RC2512_High-Power Datasheet <file:///C:\Eagle-Datasheet\Widerstaende\RC2512_High-Power_Yageo-Phycomp.pdf> Dickschichtwiderstand; DISTRI_1: Farnell; DISTRI_1-NR: 1469741; DISTRI_1-PREIS: 0,019; HERSTELLER: Vishay; HERSTELLER-NR: CRCW06031K20FKEA; MARKING: 1201; SIZE: 0603; UKAT: I; UMAT: Met; UPV: 100mW; URISO: >1,00GOhm; UTERM: Sn; UTK: 100PPM/°C; UTMAX: 155°C; UTMIN: -55°C; UTOL: 1%; UTYP: Thickfilm; UVAL: 1.20K; UVDC: 75,0V; UVISO: 100V
R501-R513 R601-R613 R909 R910 R1009 R1010 = foxBMS_BMS-Slave_12cell:100R?*_REV_01: 100R SMD - CHIP - Dickschichtwiderstand Vishay D/CRCW_Vishay_Datasheet <file:///C:\Eagle-Datasheet\Widerstaende\CRCW_Vishay.pdf> Yageo/Phycomp RC0402_Datasheet <file:///C:\Eagle-Datasheet\Widerstaende\RC0402_Yageo-Phycomp.pdf>_____RL0402_Datasheet <file:///C:\Eagle-Datasheet\Widerstaende\RL0402_0603_0805_1206_1210_1218_2010_2512_Yageo-Phycomp.pdf> RC0603_Datasheet <file:///C:\Eagle-Datasheet\Widerstaende\RC0603_Yageo-Phycomp.pdf>_____RL0603_Datasheet <file:///C:\Eagle-Datasheet\Widerstaende\RL0402_0603_0805_1206_1210_1218_2010_2512_Yageo-Phycomp.pdf> RC0805_Datasheet <file:///C:\Eagle-Datasheet\Widerstaende\RC0805_Yageo-Phycomp.pdf>_____RL0805_Datasheet <file:///C:\Eagle-Datasheet\Widerstaende\RL0402_0603_0805_1206_1210_1218_2010_2512_Yageo-Phycomp.pdf> RL0805_High-Power Datasheet <file:///C:\Eagle-Datasheet\Widerstaende\RL0805_1206_High-Power_Yageo-Phycomp.pdf> RC1206_Datasheet <file:///C:\Eagle-Datasheet\Widerstaende\RC1206_Yageo-Phycomp.pdf>_____RL1206_Datasheet <file:///C:\Eagle-Datasheet\Widerstaende\RL0402_0603_0805_1206_1210_1218_2010_2512_Yageo-Phycomp.pdf> RL1206_High-Power Datasheet <file:///C:\Eagle-Datasheet\Widerstaende\RL0805_1206_High-Power_Yageo-Phycomp.pdf> RC1210_Datasheet <file:///C:\Eagle-Datasheet\Widerstaende\RC1210_Yageo-Phycomp.pdf>_____RL1210_Datasheet <file:///C:\Eagle-Datasheet\Widerstaende\RL0402_0603_0805_1206_1210_1218_2010_2512_Yageo-Phycomp.pdf> RC1218_Datasheet <file:///C:\Eagle-Datasheet\Widerstaende\RC1218_Yageo-Phycomp.pdf>_____RL1218_Datasheet <file:///C:\Eagle-Datasheet\Widerstaende\RL0402_0603_0805_1206_1210_1218_2010_2512_Yageo-Phycomp.pdf> RC2010_Datasheet <file:///C:\Eagle-Datasheet\Widerstaende\RC2010_Yageo-Phycomp.pdf>_____RL2010_Datasheet <file:///C:\Eagle-Datasheet\Widerstaende\RL0402_0603_0805_1206_1210_1218_2010_2512_Yageo-Phycomp.pdf> RC2512_Datasheet <file:///C:\Eagle-Datasheet\Widerstaende\RC2512_Yageo-Phycomp.pdf>_____RL2512_Datasheet <file:///C:\Eagle-Datasheet\Widerstaende\RL0402_0603_0805_1206_1210_1218_2010_2512_Yageo-Phycomp.pdf> RC2512_High-Power Datasheet <file:///C:\Eagle-Datasheet\Widerstaende\RC2512_High-Power_Yageo-Phycomp.pdf> Dickschichtwiderstand; DISTRI_1: Farnell; DISTRI_1-NR: 1469752; DISTRI_1-PREIS: 0,0126 / 100St; DISTRI_2: Mouser; DISTRI_2-NR: 71-CRCW0603-100-E3; DISTRI_2-PREIS: 0,009 / 100St; HERSTELLER: Vishay; HERSTELLER-NR: CRCW0603100RFKEA; MARKING: 1000; SIZE: 0603; UKAT: I; UMAT: Met; UPV: 100mW; URISO: >1,00GOhm; UTERM: Sn; UTK: 100PPM/°C; UTMAX: 155°C; UTMIN: -55°C; UTOL: 1%; UTYP: Thickfilm; UVAL: 100R; UVDC: 75,0V; UVISO: 100V
R701-R712 R719-R730 = 0_LES_WIDERSTAND.SMD.CHIP.DICKSCHICHT:68,0R?*_REV_01: 68,0R SMD - CHIP - Dickschichtwiderstand Vishay D/CRCW_Vishay_Datasheet <file:///C:\Eagle-Datasheet\Widerstaende\CRCW_Vishay.pdf> Yageo/Phycomp RC0402_Datasheet <file:///C:\Eagle-Datasheet\Widerstaende\RC0402_Yageo-Phycomp.pdf>_____RL0402_Datasheet <file:///C:\Eagle-Datasheet\Widerstaende\RL0402_0603_0805_1206_1210_1218_2010_2512_Yageo-Phycomp.pdf> RC0603_Datasheet <file:///C:\Eagle-Datasheet\Widerstaende\RC0603_Yageo-Phycomp.pdf>_____RL0603_Datasheet <file:///C:\Eagle-Datasheet\Widerstaende\RL0402_0603_0805_1206_1210_1218_2010_2512_Yageo-Phycomp.pdf> RC0805_Datasheet <file:///C:\Eagle-Datasheet\Widerstaende\RC0805_Yageo-Phycomp.pdf>_____RL0805_Datasheet <file:///C:\Eagle-Datasheet\Widerstaende\RL0402_0603_0805_1206_1210_1218_2010_2512_Yageo-Phycomp.pdf> RL0805_High-Power Datasheet <file:///C:\Eagle-Datasheet\Widerstaende\RL0805_1206_High-Power_Yageo-Phycomp.pdf> RC1206_Datasheet <file:///C:\Eagle-Datasheet\Widerstaende\RC1206_Yageo-Phycomp.pdf>_____RL1206_Datasheet <file:///C:\Eagle-Datasheet\Widerstaende\RL0402_0603_0805_1206_1210_1218_2010_2512_Yageo-Phycomp.pdf> RL1206_High-Power Datasheet <file:///C:\Eagle-Datasheet\Widerstaende\RL0805_1206_High-Power_Yageo-Phycomp.pdf> RC1210_Datasheet <file:///C:\Eagle-Datasheet\Widerstaende\RC1210_Yageo-Phycomp.pdf>_____RL1210_Datasheet <file:///C:\Eagle-Datasheet\Widerstaende\RL0402_0603_0805_1206_1210_1218_2010_2512_Yageo-Phycomp.pdf> RC1218_Datasheet <file:///C:\Eagle-Datasheet\Widerstaende\RC1218_Yageo-Phycomp.pdf>_____RL1218_Datasheet <file:///C:\Eagle-Datasheet\Widerstaende\RL0402_0603_0805_1206_1210_1218_2010_2512_Yageo-Phycomp.pdf> RC2010_Datasheet <file:///C:\Eagle-Datasheet\Widerstaende\RC2010_Yageo-Phycomp.pdf>_____RL2010_Datasheet <file:///C:\Eagle-Datasheet\Widerstaende\RL0402_0603_0805_1206_1210_1218_2010_2512_Yageo-Phycomp.pdf> RC2512_Datasheet <file:///C:\Eagle-Datasheet\Widerstaende\RC2512_Yageo-Phycomp.pdf>_____RL2512_Datasheet <file:///C:\Eagle-Datasheet\Widerstaende\RL0402_0603_0805_1206_1210_1218_2010_2512_Yageo-Phycomp.pdf> RC2512_High-Power Datasheet <file:///C:\Eagle-Datasheet\Widerstaende\RC2512_High-Power_Yageo-Phycomp.pdf> Dickschichtwiderstand; DISTRI_1: Bürklin; DISTRI_1-NR: 08E244; DISTRI_1-PREIS: 0,04€; HERSTELLER: Yageo / Phycomp; HERSTELLER-NR: RC1210JR-0768RL; MARKING: 680; SIZE: 2010; UKAT: I; UMAT: Met; UPV: 750mW; URISO: ≥10,0GOhm; UTERM: Sn; UTK: 100PPM/°C; UTMAX: 155°C; UTMIN: -55°C; UTOL: 5%; UTYP: Thickfilm; UVAL: 68.0R; UVDC: 200V; UVISO: 500V; UVMAX: 500V
R713-R718 R731-R736 = foxBMS_BMS-Slave_12cell:3,30K?*_REV_01: 3,30K SMD - CHIP - Dickschichtwiderstand Vishay D/CRCW_Vishay_Datasheet <file:///C:\Eagle-Datasheet\Widerstaende\CRCW_Vishay.pdf> Yageo/Phycomp RC0402_Datasheet <file:///C:\Eagle-Datasheet\Widerstaende\RC0402_Yageo-Phycomp.pdf>_____RL0402_Datasheet <file:///C:\Eagle-Datasheet\Widerstaende\RL0402_0603_0805_1206_1210_1218_2010_2512_Yageo-Phycomp.pdf> RC0603_Datasheet <file:///C:\Eagle-Datasheet\Widerstaende\RC0603_Yageo-Phycomp.pdf>_____RL0603_Datasheet <file:///C:\Eagle-Datasheet\Widerstaende\RL0402_0603_0805_1206_1210_1218_2010_2512_Yageo-Phycomp.pdf> RC0805_Datasheet <file:///C:\Eagle-Datasheet\Widerstaende\RC0805_Yageo-Phycomp.pdf>_____RL0805_Datasheet <file:///C:\Eagle-Datasheet\Widerstaende\RL0402_0603_0805_1206_1210_1218_2010_2512_Yageo-Phycomp.pdf> RL0805_High-Power Datasheet <file:///C:\Eagle-Datasheet\Widerstaende\RL0805_1206_High-Power_Yageo-Phycomp.pdf> RC1206_Datasheet <file:///C:\Eagle-Datasheet\Widerstaende\RC1206_Yageo-Phycomp.pdf>_____RL1206_Datasheet <file:///C:\Eagle-Datasheet\Widerstaende\RL0402_0603_0805_1206_1210_1218_2010_2512_Yageo-Phycomp.pdf> RL1206_High-Power Datasheet <file:///C:\Eagle-Datasheet\Widerstaende\RL0805_1206_High-Power_Yageo-Phycomp.pdf> RC1210_Datasheet <file:///C:\Eagle-Datasheet\Widerstaende\RC1210_Yageo-Phycomp.pdf>_____RL1210_Datasheet <file:///C:\Eagle-Datasheet\Widerstaende\RL0402_0603_0805_1206_1210_1218_2010_2512_Yageo-Phycomp.pdf> RC1218_Datasheet <file:///C:\Eagle-Datasheet\Widerstaende\RC1218_Yageo-Phycomp.pdf>_____RL1218_Datasheet <file:///C:\Eagle-Datasheet\Widerstaende\RL0402_0603_0805_1206_1210_1218_2010_2512_Yageo-Phycomp.pdf> RC2010_Datasheet <file:///C:\Eagle-Datasheet\Widerstaende\RC2010_Yageo-Phycomp.pdf>_____RL2010_Datasheet <file:///C:\Eagle-Datasheet\Widerstaende\RL0402_0603_0805_1206_1210_1218_2010_2512_Yageo-Phycomp.pdf> RC2512_Datasheet <file:///C:\Eagle-Datasheet\Widerstaende\RC2512_Yageo-Phycomp.pdf>_____RL2512_Datasheet <file:///C:\Eagle-Datasheet\Widerstaende\RL0402_0603_0805_1206_1210_1218_2010_2512_Yageo-Phycomp.pdf> RC2512_High-Power Datasheet <file:///C:\Eagle-Datasheet\Widerstaende\RC2512_High-Power_Yageo-Phycomp.pdf> Dickschichtwiderstand; DISTRI_1: Farnell; DISTRI_1-NR: 1469793; DISTRI_1-PREIS: 0,019; DISTRI_2: Mouser; DISTRI_2-NR: 71-CRCW0603-3.3K-E3; DISTRI_2-PREIS: 0,009 / 100St; HERSTELLER: Vishay; HERSTELLER-NR: CRCW06033K30FKEA; MARKING: 3301; SIZE: 0603; UKAT: I; UMAT: Met; UPV: 100mW; URISO: >1,00GOhm; UTERM: Sn; UTK: 100PPM/°C; UTMAX: 155°C; UTMIN: -55°C; UTOL: 1%; UTYP: Thickfilm; UVAL: 3.30K; UVDC: 75,0V; UVISO: 100V
R801-R812 = foxBMS_BMS-Slave_12cell:150R?*_REV_01: 150R SMD - CHIP - Dickschichtwiderstand Vishay D/CRCW_Vishay_Datasheet <file:///C:\Eagle-Datasheet\Widerstaende\CRCW_Vishay.pdf> Yageo/Phycomp RC0402_Datasheet <file:///C:\Eagle-Datasheet\Widerstaende\RC0402_Yageo-Phycomp.pdf>_____RL0402_Datasheet <file:///C:\Eagle-Datasheet\Widerstaende\RL0402_0603_0805_1206_1210_1218_2010_2512_Yageo-Phycomp.pdf> RC0603_Datasheet <file:///C:\Eagle-Datasheet\Widerstaende\RC0603_Yageo-Phycomp.pdf>_____RL0603_Datasheet <file:///C:\Eagle-Datasheet\Widerstaende\RL0402_0603_0805_1206_1210_1218_2010_2512_Yageo-Phycomp.pdf> RC0805_Datasheet <file:///C:\Eagle-Datasheet\Widerstaende\RC0805_Yageo-Phycomp.pdf>_____RL0805_Datasheet <file:///C:\Eagle-Datasheet\Widerstaende\RL0402_0603_0805_1206_1210_1218_2010_2512_Yageo-Phycomp.pdf> RL0805_High-Power Datasheet <file:///C:\Eagle-Datasheet\Widerstaende\RL0805_1206_High-Power_Yageo-Phycomp.pdf> RC1206_Datasheet <file:///C:\Eagle-Datasheet\Widerstaende\RC1206_Yageo-Phycomp.pdf>_____RL1206_Datasheet <file:///C:\Eagle-Datasheet\Widerstaende\RL0402_0603_0805_1206_1210_1218_2010_2512_Yageo-Phycomp.pdf> RL1206_High-Power Datasheet <file:///C:\Eagle-Datasheet\Widerstaende\RL0805_1206_High-Power_Yageo-Phycomp.pdf> RC1210_Datasheet <file:///C:\Eagle-Datasheet\Widerstaende\RC1210_Yageo-Phycomp.pdf>_____RL1210_Datasheet <file:///C:\Eagle-Datasheet\Widerstaende\RL0402_0603_0805_1206_1210_1218_2010_2512_Yageo-Phycomp.pdf> RC1218_Datasheet <file:///C:\Eagle-Datasheet\Widerstaende\RC1218_Yageo-Phycomp.pdf>_____RL1218_Datasheet <file:///C:\Eagle-Datasheet\Widerstaende\RL0402_0603_0805_1206_1210_1218_2010_2512_Yageo-Phycomp.pdf> RC2010_Datasheet <file:///C:\Eagle-Datasheet\Widerstaende\RC2010_Yageo-Phycomp.pdf>_____RL2010_Datasheet <file:///C:\Eagle-Datasheet\Widerstaende\RL0402_0603_0805_1206_1210_1218_2010_2512_Yageo-Phycomp.pdf> RC2512_Datasheet <file:///C:\Eagle-Datasheet\Widerstaende\RC2512_Yageo-Phycomp.pdf>_____RL2512_Datasheet <file:///C:\Eagle-Datasheet\Widerstaende\RL0402_0603_0805_1206_1210_1218_2010_2512_Yageo-Phycomp.pdf> RC2512_High-Power Datasheet <file:///C:\Eagle-Datasheet\Widerstaende\RC2512_High-Power_Yageo-Phycomp.pdf> Dickschichtwiderstand; DISTRI_1: Farnell; DISTRI_1-NR: 1469760; DISTRI_1-PREIS: 0,0122 / 100St; DISTRI_2: Mouser; DISTRI_2-NR: 71-CRCW0603-150-E3; DISTRI_2-PREIS: 0,009 / 100St; HERSTELLER: Vishay; HERSTELLER-NR: CRCW0603150RFKEA; MARKING: 1500; SIZE: 0603; UKAT: I; UMAT: Met; UPV: 100mW; URISO: >1,00GOhm; UTERM: Sn; UTK: 100PPM/°C; UTMAX: 155°C; UTMIN: -55°C; UTOL: 1%; UTYP: Thickfilm; UVAL: 150R; UVDC: 75,0V; UVISO: 100V
R813 R901-R908 R1001-R1008 R1101-R1108 R1201-R1208 R1301 R1302 R1401 R1402 = foxBMS_BMS-Slave_12cell:10,0K?*_REV_01: 10,0K SMD - CHIP - Dickschichtwiderstand Vishay D/CRCW_Vishay_Datasheet <file:///C:\Eagle-Datasheet\Widerstaende\CRCW_Vishay.pdf> Yageo/Phycomp RC0402_Datasheet <file:///C:\Eagle-Datasheet\Widerstaende\RC0402_Yageo-Phycomp.pdf>_____RL0402_Datasheet <file:///C:\Eagle-Datasheet\Widerstaende\RL0402_0603_0805_1206_1210_1218_2010_2512_Yageo-Phycomp.pdf> RC0603_Datasheet <file:///C:\Eagle-Datasheet\Widerstaende\RC0603_Yageo-Phycomp.pdf>_____RL0603_Datasheet <file:///C:\Eagle-Datasheet\Widerstaende\RL0402_0603_0805_1206_1210_1218_2010_2512_Yageo-Phycomp.pdf> RC0805_Datasheet <file:///C:\Eagle-Datasheet\Widerstaende\RC0805_Yageo-Phycomp.pdf>_____RL0805_Datasheet <file:///C:\Eagle-Datasheet\Widerstaende\RL0402_0603_0805_1206_1210_1218_2010_2512_Yageo-Phycomp.pdf> RL0805_High-Power Datasheet <file:///C:\Eagle-Datasheet\Widerstaende\RL0805_1206_High-Power_Yageo-Phycomp.pdf> RC1206_Datasheet <file:///C:\Eagle-Datasheet\Widerstaende\RC1206_Yageo-Phycomp.pdf>_____RL1206_Datasheet <file:///C:\Eagle-Datasheet\Widerstaende\RL0402_0603_0805_1206_1210_1218_2010_2512_Yageo-Phycomp.pdf> RL1206_High-Power Datasheet <file:///C:\Eagle-Datasheet\Widerstaende\RL0805_1206_High-Power_Yageo-Phycomp.pdf> RC1210_Datasheet <file:///C:\Eagle-Datasheet\Widerstaende\RC1210_Yageo-Phycomp.pdf>_____RL1210_Datasheet <file:///C:\Eagle-Datasheet\Widerstaende\RL0402_0603_0805_1206_1210_1218_2010_2512_Yageo-Phycomp.pdf> RC1218_Datasheet <file:///C:\Eagle-Datasheet\Widerstaende\RC1218_Yageo-Phycomp.pdf>_____RL1218_Datasheet <file:///C:\Eagle-Datasheet\Widerstaende\RL0402_0603_0805_1206_1210_1218_2010_2512_Yageo-Phycomp.pdf> RC2010_Datasheet <file:///C:\Eagle-Datasheet\Widerstaende\RC2010_Yageo-Phycomp.pdf>_____RL2010_Datasheet <file:///C:\Eagle-Datasheet\Widerstaende\RL0402_0603_0805_1206_1210_1218_2010_2512_Yageo-Phycomp.pdf> RC2512_Datasheet <file:///C:\Eagle-Datasheet\Widerstaende\RC2512_Yageo-Phycomp.pdf>_____RL2512_Datasheet <file:///C:\Eagle-Datasheet\Widerstaende\RL0402_0603_0805_1206_1210_1218_2010_2512_Yageo-Phycomp.pdf> RC2512_High-Power Datasheet <file:///C:\Eagle-Datasheet\Widerstaende\RC2512_High-Power_Yageo-Phycomp.pdf> Dickschichtwiderstand; DISTRI_1: Farnell; DISTRI_1-NR: 1469748; DISTRI_1-PREIS: 0,019; HERSTELLER: Vishay; HERSTELLER-NR: CRCW060310K0FKEA; MARKING: 1002; SIZE: 0603; UKAT: I; UMAT: Met; UPV: 100mW; URISO: >1,00GOhm; UTERM: Sn; UTK: 100PPM/°C; UTMAX: 155°C; UTMIN: -55°C; UTOL: 1%; UTYP: Thickfilm; UVAL: 10.0K; UVDC: 75,0V; UVISO: 100V
R1601 = 0_LES_WIDERSTAND.SMD.CHIP.DICKSCHICHT:390K?*_REV_01: 390K SMD - CHIP - Dickschichtwiderstand Vishay D/CRCW_Vishay_Datasheet <file:///C:\Eagle-Datasheet\Widerstaende\CRCW_Vishay.pdf> Yageo/Phycomp RC0402_Datasheet <file:///C:\Eagle-Datasheet\Widerstaende\RC0402_Yageo-Phycomp.pdf>_____RL0402_Datasheet <file:///C:\Eagle-Datasheet\Widerstaende\RL0402_0603_0805_1206_1210_1218_2010_2512_Yageo-Phycomp.pdf> RC0603_Datasheet <file:///C:\Eagle-Datasheet\Widerstaende\RC0603_Yageo-Phycomp.pdf>_____RL0603_Datasheet <file:///C:\Eagle-Datasheet\Widerstaende\RL0402_0603_0805_1206_1210_1218_2010_2512_Yageo-Phycomp.pdf> RC0805_Datasheet <file:///C:\Eagle-Datasheet\Widerstaende\RC0805_Yageo-Phycomp.pdf>_____RL0805_Datasheet <file:///C:\Eagle-Datasheet\Widerstaende\RL0402_0603_0805_1206_1210_1218_2010_2512_Yageo-Phycomp.pdf> RL0805_High-Power Datasheet <file:///C:\Eagle-Datasheet\Widerstaende\RL0805_1206_High-Power_Yageo-Phycomp.pdf> RC1206_Datasheet <file:///C:\Eagle-Datasheet\Widerstaende\RC1206_Yageo-Phycomp.pdf>_____RL1206_Datasheet <file:///C:\Eagle-Datasheet\Widerstaende\RL0402_0603_0805_1206_1210_1218_2010_2512_Yageo-Phycomp.pdf> RL1206_High-Power Datasheet <file:///C:\Eagle-Datasheet\Widerstaende\RL0805_1206_High-Power_Yageo-Phycomp.pdf> RC1210_Datasheet <file:///C:\Eagle-Datasheet\Widerstaende\RC1210_Yageo-Phycomp.pdf>_____RL1210_Datasheet <file:///C:\Eagle-Datasheet\Widerstaende\RL0402_0603_0805_1206_1210_1218_2010_2512_Yageo-Phycomp.pdf> RC1218_Datasheet <file:///C:\Eagle-Datasheet\Widerstaende\RC1218_Yageo-Phycomp.pdf>_____RL1218_Datasheet <file:///C:\Eagle-Datasheet\Widerstaende\RL0402_0603_0805_1206_1210_1218_2010_2512_Yageo-Phycomp.pdf> RC2010_Datasheet <file:///C:\Eagle-Datasheet\Widerstaende\RC2010_Yageo-Phycomp.pdf>_____RL2010_Datasheet <file:///C:\Eagle-Datasheet\Widerstaende\RL0402_0603_0805_1206_1210_1218_2010_2512_Yageo-Phycomp.pdf> RC2512_Datasheet <file:///C:\Eagle-Datasheet\Widerstaende\RC2512_Yageo-Phycomp.pdf>_____RL2512_Datasheet <file:///C:\Eagle-Datasheet\Widerstaende\RL0402_0603_0805_1206_1210_1218_2010_2512_Yageo-Phycomp.pdf> RC2512_High-Power Datasheet <file:///C:\Eagle-Datasheet\Widerstaende\RC2512_High-Power_Yageo-Phycomp.pdf> Dickschichtwiderstand; DISTRI_1: Farnell; DISTRI_1-NR: 2138557; DISTRI_1-PREIS: 0,0095€ / 100St; DISTRI_2: Mouser; DISTRI_2-NR: 71-CRCW0603-390K-E3; DISTRI_2-PREIS: 0,009€ / 100St; HERSTELLER: Vishay; HERSTELLER-NR: CRCW0603390KFKEA; MARKING: 3903; SIZE: 0603; UKAT: I; UMAT: Met; UPV: 100mW; URISO: >1,00GOhm; UTERM: Sn; UTK: 100PPM/°C; UTMAX: 155°C; UTMIN: -55°C; UTOL: 1%; UTYP: Thickfilm; UVAL: 390K; UVDC: 75,0V; UVISO: 100V
R1602 = 0_LES_WIDERSTAND.SMD.CHIP.DICKSCHICHT:86,6K?*_REV_01: 86,6K SMD - CHIP - Dickschichtwiderstand Vishay D/CRCW_Vishay_Datasheet <file:///C:\Eagle-Datasheet\Widerstaende\CRCW_Vishay.pdf> Yageo/Phycomp RC0402_Datasheet <file:///C:\Eagle-Datasheet\Widerstaende\RC0402_Yageo-Phycomp.pdf>_____RL0402_Datasheet <file:///C:\Eagle-Datasheet\Widerstaende\RL0402_0603_0805_1206_1210_1218_2010_2512_Yageo-Phycomp.pdf> RC0603_Datasheet <file:///C:\Eagle-Datasheet\Widerstaende\RC0603_Yageo-Phycomp.pdf>_____RL0603_Datasheet <file:///C:\Eagle-Datasheet\Widerstaende\RL0402_0603_0805_1206_1210_1218_2010_2512_Yageo-Phycomp.pdf> RC0805_Datasheet <file:///C:\Eagle-Datasheet\Widerstaende\RC0805_Yageo-Phycomp.pdf>_____RL0805_Datasheet <file:///C:\Eagle-Datasheet\Widerstaende\RL0402_0603_0805_1206_1210_1218_2010_2512_Yageo-Phycomp.pdf> RL0805_High-Power Datasheet <file:///C:\Eagle-Datasheet\Widerstaende\RL0805_1206_High-Power_Yageo-Phycomp.pdf> RC1206_Datasheet <file:///C:\Eagle-Datasheet\Widerstaende\RC1206_Yageo-Phycomp.pdf>_____RL1206_Datasheet <file:///C:\Eagle-Datasheet\Widerstaende\RL0402_0603_0805_1206_1210_1218_2010_2512_Yageo-Phycomp.pdf> RL1206_High-Power Datasheet <file:///C:\Eagle-Datasheet\Widerstaende\RL0805_1206_High-Power_Yageo-Phycomp.pdf> RC1210_Datasheet <file:///C:\Eagle-Datasheet\Widerstaende\RC1210_Yageo-Phycomp.pdf>_____RL1210_Datasheet <file:///C:\Eagle-Datasheet\Widerstaende\RL0402_0603_0805_1206_1210_1218_2010_2512_Yageo-Phycomp.pdf> RC1218_Datasheet <file:///C:\Eagle-Datasheet\Widerstaende\RC1218_Yageo-Phycomp.pdf>_____RL1218_Datasheet <file:///C:\Eagle-Datasheet\Widerstaende\RL0402_0603_0805_1206_1210_1218_2010_2512_Yageo-Phycomp.pdf> RC2010_Datasheet <file:///C:\Eagle-Datasheet\Widerstaende\RC2010_Yageo-Phycomp.pdf>_____RL2010_Datasheet <file:///C:\Eagle-Datasheet\Widerstaende\RL0402_0603_0805_1206_1210_1218_2010_2512_Yageo-Phycomp.pdf> RC2512_Datasheet <file:///C:\Eagle-Datasheet\Widerstaende\RC2512_Yageo-Phycomp.pdf>_____RL2512_Datasheet <file:///C:\Eagle-Datasheet\Widerstaende\RL0402_0603_0805_1206_1210_1218_2010_2512_Yageo-Phycomp.pdf> RC2512_High-Power Datasheet <file:///C:\Eagle-Datasheet\Widerstaende\RC2512_High-Power_Yageo-Phycomp.pdf> Dickschichtwiderstand; DISTRI_1: Farnell; DISTRI_1-NR: 1652901; DISTRI_1-PREIS: 0,013€ / 100St; DISTRI_2: Mouser; DISTRI_2-NR: 71-CRCW0603-86.6K-E3; DISTRI_2-PREIS: 0,009€ / 100St; HERSTELLER: Vishay; HERSTELLER-NR: CRCW060386K6FKEA; MARKING: 8662; SIZE: 0603; UKAT: I; UMAT: Met; UPV: 100mW; URISO: >1,00GOhm; UTERM: Sn; UTK: 100PPM/°C; UTMAX: 155°C; UTMIN: -55°C; UTOL: 1%; UTYP: Thickfilm; UVAL: 86.6K; UVDC: 75,0V; UVISO: 100V
R1603 = 0_LES_WIDERSTAND.SMD.CHIP.DICKSCHICHT:39,0R?*_REV_01: 39,0R SMD - CHIP - Dickschichtwiderstand Vishay D/CRCW_Vishay_Datasheet <file:///C:\Eagle-Datasheet\Widerstaende\CRCW_Vishay.pdf> Yageo/Phycomp RC0402_Datasheet <file:///C:\Eagle-Datasheet\Widerstaende\RC0402_Yageo-Phycomp.pdf>_____RL0402_Datasheet <file:///C:\Eagle-Datasheet\Widerstaende\RL0402_0603_0805_1206_1210_1218_2010_2512_Yageo-Phycomp.pdf> RC0603_Datasheet <file:///C:\Eagle-Datasheet\Widerstaende\RC0603_Yageo-Phycomp.pdf>_____RL0603_Datasheet <file:///C:\Eagle-Datasheet\Widerstaende\RL0402_0603_0805_1206_1210_1218_2010_2512_Yageo-Phycomp.pdf> RC0805_Datasheet <file:///C:\Eagle-Datasheet\Widerstaende\RC0805_Yageo-Phycomp.pdf>_____RL0805_Datasheet <file:///C:\Eagle-Datasheet\Widerstaende\RL0402_0603_0805_1206_1210_1218_2010_2512_Yageo-Phycomp.pdf> RL0805_High-Power Datasheet <file:///C:\Eagle-Datasheet\Widerstaende\RL0805_1206_High-Power_Yageo-Phycomp.pdf> RC1206_Datasheet <file:///C:\Eagle-Datasheet\Widerstaende\RC1206_Yageo-Phycomp.pdf>_____RL1206_Datasheet <file:///C:\Eagle-Datasheet\Widerstaende\RL0402_0603_0805_1206_1210_1218_2010_2512_Yageo-Phycomp.pdf> RL1206_High-Power Datasheet <file:///C:\Eagle-Datasheet\Widerstaende\RL0805_1206_High-Power_Yageo-Phycomp.pdf> RC1210_Datasheet <file:///C:\Eagle-Datasheet\Widerstaende\RC1210_Yageo-Phycomp.pdf>_____RL1210_Datasheet <file:///C:\Eagle-Datasheet\Widerstaende\RL0402_0603_0805_1206_1210_1218_2010_2512_Yageo-Phycomp.pdf> RC1218_Datasheet <file:///C:\Eagle-Datasheet\Widerstaende\RC1218_Yageo-Phycomp.pdf>_____RL1218_Datasheet <file:///C:\Eagle-Datasheet\Widerstaende\RL0402_0603_0805_1206_1210_1218_2010_2512_Yageo-Phycomp.pdf> RC2010_Datasheet <file:///C:\Eagle-Datasheet\Widerstaende\RC2010_Yageo-Phycomp.pdf>_____RL2010_Datasheet <file:///C:\Eagle-Datasheet\Widerstaende\RL0402_0603_0805_1206_1210_1218_2010_2512_Yageo-Phycomp.pdf> RC2512_Datasheet <file:///C:\Eagle-Datasheet\Widerstaende\RC2512_Yageo-Phycomp.pdf>_____RL2512_Datasheet <file:///C:\Eagle-Datasheet\Widerstaende\RL0402_0603_0805_1206_1210_1218_2010_2512_Yageo-Phycomp.pdf> RC2512_High-Power Datasheet <file:///C:\Eagle-Datasheet\Widerstaende\RC2512_High-Power_Yageo-Phycomp.pdf> Dickschichtwiderstand; DISTRI_1: Farnell; DISTRI_1-NR: 1738941; DISTRI_1-PREIS: 0,0572€ / 100St; DISTRI_2: Mouser; DISTRI_2-NR: 71-CRCW080539R0FKEA; DISTRI_2-PREIS: 0,028€ / 100St; HERSTELLER: Vishay; HERSTELLER-NR: CRCW080539R0FKEA; MARKING: 39R0; SIZE: 0805; UKAT: I; UMAT: Met; UPV: 125mW; URISO: >1,00GOhm; UTERM: Sn; UTK: 100PPM/°C; UTMAX: 155°C; UTMIN: -55°C; UTOL: 1%; UTYP: Thickfilm; UVAL: 39.0R; UVDC: 150V; UVISO: 200V
R1604 = 0_LES_WIDERSTAND.SMD.CHIP.DICKSCHICHT:DUMMY_R_CHIP: DUMMY - SMD - CHIP - Dickschichtwiderstand Vishay D/CRCW_Vishay_Datasheet <file:///C:\Eagle-Datasheet\Widerstaende\CRCW_Vishay.pdf> Yageo/Phycomp RC0402_Datasheet <file:///C:\Eagle-Datasheet\Widerstaende\RC0402_Yageo-Phycomp.pdf>_____RL0402_Datasheet <file:///C:\Eagle-Datasheet\Widerstaende\RL0402_0603_0805_1206_1210_1218_2010_2512_Yageo-Phycomp.pdf> RC0603_Datasheet <file:///C:\Eagle-Datasheet\Widerstaende\RC0603_Yageo-Phycomp.pdf>_____RL0603_Datasheet <file:///C:\Eagle-Datasheet\Widerstaende\RL0402_0603_0805_1206_1210_1218_2010_2512_Yageo-Phycomp.pdf> RC0805_Datasheet <file:///C:\Eagle-Datasheet\Widerstaende\RC0805_Yageo-Phycomp.pdf>_____RL0805_Datasheet <file:///C:\Eagle-Datasheet\Widerstaende\RL0402_0603_0805_1206_1210_1218_2010_2512_Yageo-Phycomp.pdf> RL0805_High-Power Datasheet <file:///C:\Eagle-Datasheet\Widerstaende\RL0805_1206_High-Power_Yageo-Phycomp.pdf> RC1206_Datasheet <file:///C:\Eagle-Datasheet\Widerstaende\RC1206_Yageo-Phycomp.pdf>_____RL1206_Datasheet <file:///C:\Eagle-Datasheet\Widerstaende\RL0402_0603_0805_1206_1210_1218_2010_2512_Yageo-Phycomp.pdf> RL1206_High-Power Datasheet <file:///C:\Eagle-Datasheet\Widerstaende\RL0805_1206_High-Power_Yageo-Phycomp.pdf> RC1210_Datasheet <file:///C:\Eagle-Datasheet\Widerstaende\RC1210_Yageo-Phycomp.pdf>_____RL1210_Datasheet <file:///C:\Eagle-Datasheet\Widerstaende\RL0402_0603_0805_1206_1210_1218_2010_2512_Yageo-Phycomp.pdf> RC1218_Datasheet <file:///C:\Eagle-Datasheet\Widerstaende\RC1218_Yageo-Phycomp.pdf>_____RL1218_Datasheet <file:///C:\Eagle-Datasheet\Widerstaende\RL0402_0603_0805_1206_1210_1218_2010_2512_Yageo-Phycomp.pdf> RC2010_Datasheet <file:///C:\Eagle-Datasheet\Widerstaende\RC2010_Yageo-Phycomp.pdf>_____RL2010_Datasheet <file:///C:\Eagle-Datasheet\Widerstaende\RL0402_0603_0805_1206_1210_1218_2010_2512_Yageo-Phycomp.pdf> RC2512_Datasheet <file:///C:\Eagle-Datasheet\Widerstaende\RC2512_Yageo-Phycomp.pdf>_____RL2512_Datasheet <file:///C:\Eagle-Datasheet\Widerstaende\RL0402_0603_0805_1206_1210_1218_2010_2512_Yageo-Phycomp.pdf> RC2512_High-Power Datasheet <file:///C:\Eagle-Datasheet\Widerstaende\RC2512_High-Power_Yageo-Phycomp.pdf> Dickschichtwiderstand; HERSTELLER: Vishay; SIZE: 0603; UKAT: I; UMAT: Met; UPV: 100mW; URISO: >1,00GOhm; UTERM: Sn; UTMAX: 155°C; UTMIN: -55°C; UTYP: Thickfilm; UVAL: TBD; UVDC: 75,0V; UVISO: 100V
R1605 = 0_LES_WIDERSTAND.SMD.CHIP.DICKSCHICHT:127K?*_REV_01: 127K SMD - CHIP - Dickschichtwiderstand Vishay D/CRCW_Vishay_Datasheet <file:///C:\Eagle-Datasheet\Widerstaende\CRCW_Vishay.pdf> Yageo/Phycomp RC0402_Datasheet <file:///C:\Eagle-Datasheet\Widerstaende\RC0402_Yageo-Phycomp.pdf>_____RL0402_Datasheet <file:///C:\Eagle-Datasheet\Widerstaende\RL0402_0603_0805_1206_1210_1218_2010_2512_Yageo-Phycomp.pdf> RC0603_Datasheet <file:///C:\Eagle-Datasheet\Widerstaende\RC0603_Yageo-Phycomp.pdf>_____RL0603_Datasheet <file:///C:\Eagle-Datasheet\Widerstaende\RL0402_0603_0805_1206_1210_1218_2010_2512_Yageo-Phycomp.pdf> RC0805_Datasheet <file:///C:\Eagle-Datasheet\Widerstaende\RC0805_Yageo-Phycomp.pdf>_____RL0805_Datasheet <file:///C:\Eagle-Datasheet\Widerstaende\RL0402_0603_0805_1206_1210_1218_2010_2512_Yageo-Phycomp.pdf> RL0805_High-Power Datasheet <file:///C:\Eagle-Datasheet\Widerstaende\RL0805_1206_High-Power_Yageo-Phycomp.pdf> RC1206_Datasheet <file:///C:\Eagle-Datasheet\Widerstaende\RC1206_Yageo-Phycomp.pdf>_____RL1206_Datasheet <file:///C:\Eagle-Datasheet\Widerstaende\RL0402_0603_0805_1206_1210_1218_2010_2512_Yageo-Phycomp.pdf> RL1206_High-Power Datasheet <file:///C:\Eagle-Datasheet\Widerstaende\RL0805_1206_High-Power_Yageo-Phycomp.pdf> RC1210_Datasheet <file:///C:\Eagle-Datasheet\Widerstaende\RC1210_Yageo-Phycomp.pdf>_____RL1210_Datasheet <file:///C:\Eagle-Datasheet\Widerstaende\RL0402_0603_0805_1206_1210_1218_2010_2512_Yageo-Phycomp.pdf> RC1218_Datasheet <file:///C:\Eagle-Datasheet\Widerstaende\RC1218_Yageo-Phycomp.pdf>_____RL1218_Datasheet <file:///C:\Eagle-Datasheet\Widerstaende\RL0402_0603_0805_1206_1210_1218_2010_2512_Yageo-Phycomp.pdf> RC2010_Datasheet <file:///C:\Eagle-Datasheet\Widerstaende\RC2010_Yageo-Phycomp.pdf>_____RL2010_Datasheet <file:///C:\Eagle-Datasheet\Widerstaende\RL0402_0603_0805_1206_1210_1218_2010_2512_Yageo-Phycomp.pdf> RC2512_Datasheet <file:///C:\Eagle-Datasheet\Widerstaende\RC2512_Yageo-Phycomp.pdf>_____RL2512_Datasheet <file:///C:\Eagle-Datasheet\Widerstaende\RL0402_0603_0805_1206_1210_1218_2010_2512_Yageo-Phycomp.pdf> RC2512_High-Power Datasheet <file:///C:\Eagle-Datasheet\Widerstaende\RC2512_High-Power_Yageo-Phycomp.pdf> Dickschichtwiderstand; DISTRI_1: Farnell; DISTRI_1-NR: 2138509; DISTRI_1-PREIS: 0,0141€ / 100St; DISTRI_2: Mouser; DISTRI_2-NR: 71-CRCW0603-127K-E3; DISTRI_2-PREIS: 0,009€ / 100St; HERSTELLER: Vishay; HERSTELLER-NR: CRCW0603127KFKEA; MARKING: 1273; SIZE: 0603; UKAT: I; UMAT: Met; UPV: 100mW; URISO: >1,00GOhm; UTERM: Sn; UTK: 100PPM/°C; UTMAX: 155°C; UTMIN: -55°C; UTOL: 1%; UTYP: Thickfilm; UVAL: 127K; UVDC: 75,0V; UVISO: 100V
R1606 = 0_LES_WIDERSTAND.SMD.CHIP.DICKSCHICHT:10,0K?*_REV_01: 10,0K SMD - CHIP - Dickschichtwiderstand Vishay D/CRCW_Vishay_Datasheet <file:///C:\Eagle-Datasheet\Widerstaende\CRCW_Vishay.pdf> Yageo/Phycomp RC0402_Datasheet <file:///C:\Eagle-Datasheet\Widerstaende\RC0402_Yageo-Phycomp.pdf>_____RL0402_Datasheet <file:///C:\Eagle-Datasheet\Widerstaende\RL0402_0603_0805_1206_1210_1218_2010_2512_Yageo-Phycomp.pdf> RC0603_Datasheet <file:///C:\Eagle-Datasheet\Widerstaende\RC0603_Yageo-Phycomp.pdf>_____RL0603_Datasheet <file:///C:\Eagle-Datasheet\Widerstaende\RL0402_0603_0805_1206_1210_1218_2010_2512_Yageo-Phycomp.pdf> RC0805_Datasheet <file:///C:\Eagle-Datasheet\Widerstaende\RC0805_Yageo-Phycomp.pdf>_____RL0805_Datasheet <file:///C:\Eagle-Datasheet\Widerstaende\RL0402_0603_0805_1206_1210_1218_2010_2512_Yageo-Phycomp.pdf> RL0805_High-Power Datasheet <file:///C:\Eagle-Datasheet\Widerstaende\RL0805_1206_High-Power_Yageo-Phycomp.pdf> RC1206_Datasheet <file:///C:\Eagle-Datasheet\Widerstaende\RC1206_Yageo-Phycomp.pdf>_____RL1206_Datasheet <file:///C:\Eagle-Datasheet\Widerstaende\RL0402_0603_0805_1206_1210_1218_2010_2512_Yageo-Phycomp.pdf> RL1206_High-Power Datasheet <file:///C:\Eagle-Datasheet\Widerstaende\RL0805_1206_High-Power_Yageo-Phycomp.pdf> RC1210_Datasheet <file:///C:\Eagle-Datasheet\Widerstaende\RC1210_Yageo-Phycomp.pdf>_____RL1210_Datasheet <file:///C:\Eagle-Datasheet\Widerstaende\RL0402_0603_0805_1206_1210_1218_2010_2512_Yageo-Phycomp.pdf> RC1218_Datasheet <file:///C:\Eagle-Datasheet\Widerstaende\RC1218_Yageo-Phycomp.pdf>_____RL1218_Datasheet <file:///C:\Eagle-Datasheet\Widerstaende\RL0402_0603_0805_1206_1210_1218_2010_2512_Yageo-Phycomp.pdf> RC2010_Datasheet <file:///C:\Eagle-Datasheet\Widerstaende\RC2010_Yageo-Phycomp.pdf>_____RL2010_Datasheet <file:///C:\Eagle-Datasheet\Widerstaende\RL0402_0603_0805_1206_1210_1218_2010_2512_Yageo-Phycomp.pdf> RC2512_Datasheet <file:///C:\Eagle-Datasheet\Widerstaende\RC2512_Yageo-Phycomp.pdf>_____RL2512_Datasheet <file:///C:\Eagle-Datasheet\Widerstaende\RL0402_0603_0805_1206_1210_1218_2010_2512_Yageo-Phycomp.pdf> RC2512_High-Power Datasheet <file:///C:\Eagle-Datasheet\Widerstaende\RC2512_High-Power_Yageo-Phycomp.pdf> Dickschichtwiderstand; DISTRI_1: Farnell; DISTRI_1-NR: 1469748; DISTRI_1-PREIS: 0,019€; HERSTELLER: Vishay; HERSTELLER-NR: CRCW060310K0FKEA; MARKING: 1002; SIZE: 0603; UKAT: I; UMAT: Met; UPV: 100mW; URISO: >1,00GOhm; UTERM: Sn; UTK: 100PPM/°C; UTMAX: 155°C; UTMIN: -55°C; UTOL: 1%; UTYP: Thickfilm; UVAL: 10.0K; UVDC: 75,0V; UVISO: 100V
SJ401 SJ402 = foxBMS_BMS-Slave_12cell:SJ: SMD solder JUMPER
SJ901 SJ902 SJ1001 SJ1002 = foxBMS_BMS-Slave_12cell:CUSTOM_JUMPER_SJ: SMD solder Jumper
T201 T301 = foxBMS_BMS-Slave_12cell:PBHV8115Z: PBHV8115Z - NXP Datasheet www <http://cache.nxp.com/documents/data_sheet/PBHV8115Z.pdf?pspll=1> Datasheet local <file:///C:\Eagle-Datasheet\Transistoren\PBHV8115Z_NXP.pdf> NPN high-voltage low VCEsat (BISS) transistor - High voltage - Low collector-emitter saturation voltage VCEsat - High collector current capability IC and ICMv - High collector current gain (hFE) at high IC - AEC-Q101 qualified - Medium power SMD plastic package Revision Date changed by Changes ------------------------------------------------------------------------------------------ V1.0 21.04.2016 SC Ersterstellung; DISTRI_1: Farnell; DISTRI_1-NR: 1829309; DISTRI_1-PREIS: 0,185; DISTRI_2: Mouser; DISTRI_2-NR: 771-PBHV8115Z115; DISTRI_2-PREIS: 0,443; HERSTELLER: NXP; HERSTELLER-NR: PBHV8115Z; MARKING: V8115Z; PDF-LOCAL: file:///C:\Eagle-Datasheet\Transistoren\PBHV8115Z_NXP.pdf; SIZE: SOT-223; UICD_MAX: 1,00A; UKAT: I; UPV: 700mW; UTERM: Sn; UTMAX: 150°C; UTMIN: -55°C; UVAL: PBHV8115Z; UVCB: 400V; UVCE: 150V; UVEB: 6,00V
T701-T712 = foxBMS_BMS-Slave_12cell:NX2301P: NX2301P - NXP Datasheet www <http://cache.nxp.com/documents/data_sheet/NX2301P.pdf?pspll=1> Datasheet local <file:///C:\Eagle-Datasheet\Transistoren\NX2301P_NXP.pdf> P-Kanal MOSFET - P-Channel - Enhancement mode - L1.8 V RDSon rated for Low Voltage Gate Drive - AEC-Q101 qualified - Trench MOSFET technology - Very fast switching - SOT23 (TO-236AB) Surface-Mounted Device (SMD) plastic package Revision Date changed by Changes ------------------------------------------------------------------------------------------ V1.0 25.04.2016 SC Ersterstellung; DISTRI_1: Farnell; DISTRI_1-NR: 1894738; DISTRI_1-PREIS: 0,0885; DISTRI_2: Mouser; DISTRI_2-NR: 771-NX2301P215; DISTRI_2-PREIS: 0,353; HERSTELLER: NXP; HERSTELLER-NR: NX2301P,215; MARKING: MG*; SIZE: SOT23; UIDMAX: -2,00A; UKAT: I; UPV: 400mW; URDS: 100mOhm; UTERM: Sn; UTMAX: 150°C; UTMIN: -55°C; UTYP: P-Channel MOSFET; UVAL: NXP2301P,215; UVDS: -20,0V; UVGSMAX: 8,00V; UVGSMIN: -8,00V
TP201 TP203-TP207 TP209 TP210 TP301 TP303-TP307 TP309 TP310 TP1601-TP1603 = foxBMS_BMS-Slave_12cell:CUSTOM_PAD_PAD_: Testpunkte mit und ohne Durchkontaktierung in ver. Größen Nicomatic SMD-Testpunkt
TR201 TR301 = transformer_custom:HM2102NL: isoSPI Transformer; UVAL: HM2102NL
TR1601 = transformer_custom:WE_750313457: Flyback Transformer
X1501 X1502 = foxBMS_BMS-Slave_12cell:MA09-2: PIN HEADER; DISTRI_1: Farnell; DISTRI_1-NR: 2025256; DISTRI_1-PREIS: 0,94
X1503 = foxBMS_BMS-Slave_12cell:43045-24?*_MOLEX_24PIN: 43045-Serie - MOLEX 43045-2400 Datasheet www <http://www.molex.com/webdocs/datasheets/pdf/en-us/0430452400_PCB_HEADERS.pdf> Datasheet local <file:///C:\Eagle-Datasheet\Steckverbindung\430452400_Molex.pdf> 43045-2401 Datasheet www <http://www.molex.com/webdocs/datasheets/pdf/en-us/0430452401_PCB_HEADERS.pdf> Datasheet local <file:///C:\Eagle-Datasheet\Steckverbindung\430452401_Molex.pdf> 43045-2402 Datasheet www <http://www.molex.com/webdocs/datasheets/pdf/en-us/0430452402_PCB_HEADERS.pdf> Datasheet local <file:///C:\Eagle-Datasheet\Steckverbindung\430452402_Molex.pdf> - 24-Pin Buchse - liegend - Package - 2 reihig x 12-Pins - Size: 12,24mm x 39,65mm x 10,29mm - RM: 3,00mm - Farbe: Schwarz - Material: High Temperature Thermoplastic Revision Date changed by Changes ------------------------------------------------------------------------------------------ V1.0 20.04.2016 SC Ersterstellung; DISTRI_1: Farnell; DISTRI_1-NR: 1012245; DISTRI_1-PREIS: 2,53 ; HERSTELLER: Molex; HERSTELLER-NR: 43045-2400; PDF-LOCAL: file:///C:\Eagle-Datasheet\Steckverbindung\430452400_Molex.pdf; SIZE: 12,24mm x 39,65mm x 10,29mm; UCOLOR: Schwarz; UIN_MAX: 5,00A; UKAT: C; UMAT: High Temperature Thermoplastic; URISO: 1,00GOhm; UTERM: Sn; UTERMPLAT: 254nm; UTMAX: 105°C; UTMIN: -40°C; UTYP: Buchse; UVAL: 43045-2400; UVCC_MAX: 600V
X1504 X1505 = foxBMS_BMS-Slave_12cell:MA05-2: PIN HEADER; DISTRI_1: Farnell; DISTRI_1-NR: 2578720; DISTRI_1-PREIS: 0,467 
X1506 X1507 = foxBMS_BMS-Slave_12cell:43045-16?*_MOLEX_16PIN: 43045-Serie - MOLEX 43045-1600 Datasheet www <http://www.molex.com/webdocs/datasheets/pdf/en-us/0430451600_PCB_HEADERS.pdf> Datasheet local <file:///C:\Eagle-Datasheet\Steckverbindung\430451600_Molex.pdf> 43045-1601 Datasheet www <http://www.molex.com/webdocs/datasheets/pdf/en-us/0430451601_PCB_HEADERS.pdf> Datasheet local <file:///C:\Eagle-Datasheet\Steckverbindung\430451601_Molex.pdf> 43045-1602 Datasheet www <http://www.molex.com/webdocs/datasheets/pdf/en-us/0430451602_PCB_HEADERS.pdf> Datasheet local <file:///C:\Eagle-Datasheet\Steckverbindung\430451602_Molex.pdf> - 16-Pin Buchse - liegend - Package - 2 reihig x 8-Pins - Size: 12,24mm x 27,65mm x 10,29mm - RM: 3,00mm - Farbe: Schwarz - Material: High Temperature Thermoplastic Revision Date changed by Changes ------------------------------------------------------------------------------------------ V1.0 20.04.2016 SC Ersterstellung; DISTRI_1: Farnell; DISTRI_1-NR: 9961380; DISTRI_1-PREIS: 1,76; HERSTELLER: Molex; HERSTELLER-NR: 43045-1600; PDF-LOCAL: file:///C:\Eagle-Datasheet\Steckverbindung\430451600_Molex.pdf; SIZE: 12,24mm x 27,65mm x 10,29mm; UCOLOR: Schwarz; UIN_MAX: 5,00A; UKAT: C; UMAT: High Temperature Thermoplastic; URISO: 1,00GOhm; UTERM: Sn; UTERMPLAT: 254nm; UTMAX: 105°C; UTMIN: -40°C; UTYP: Buchse; UVAL: 43045-1600; UVCC_MAX: 600V
X1508 = foxBMS_BMS-Slave_12cell:MA10-2: PIN HEADER; DISTRI_1: Farnell; DISTRI_1-NR: 2025257; DISTRI_1-PREIS: 1,01
X1509-X1514 = foxBMS_BMS-Slave_12cell:43045-02?*_MOLEX_2PIN: 43045-Serie - MOLEX 43045-0200 Datasheet www <http://www.molex.com/webdocs/datasheets/pdf/en-us/0430450200_PCB_HEADERS.pdf> Datasheet local <file:///C:\Eagle-Datasheet\Steckverbindung\430450200_Molex.pdf> 43045-0201 Datasheet www <http://www.molex.com/webdocs/datasheets/pdf/en-us/0430450201_PCB_HEADERS.pdf> Datasheet local <file:///C:\Eagle-Datasheet\Steckverbindung\430450201_Molex.pdf> 43045-0202 Datasheet www <http://www.molex.com/webdocs/datasheets/pdf/en-us/0430450202_PCB_HEADERS.pdf> Datasheet local <file:///C:\Eagle-Datasheet\Steckverbindung\430450202_Molex.pdf> - 2-Pin Buchse - liegend - Package - 2 reihig x 1-Pin - Size: 15,40mm x 6,65mm x 10,29mm - RM: 3,00mm - Farbe: Schwarz - Material: High Temperature Thermoplastic Revision Date changed by Changes ------------------------------------------------------------------------------------------ V1.0 19.04.2016 SC Ersterstellung; DISTRI_1: Farnell; DISTRI_1-NR: 1012251; DISTRI_1-PREIS: 0,518; DISTRI_2: Mouser; DISTRI_2-NR: 538-43045-0200; DISTRI_2-PREIS: 0,763; HERSTELLER: Molex; HERSTELLER-NR: 43045-0200; PDF-LOCAL: file:///C:\Eagle-Datasheet\Steckverbindung\430450200_Molex.pdf; SIZE: 12,24mm x 6,65mm x 10,29mm; UCOLOR: Schwarz; UIN_MAX: 5,00A; UKAT: C; UMAT: High Temperature Thermoplastic; URISO: 1,00GOhm; UTERM: Sn; UTERMPLAT: 254nm; UTMAX: 105°C; UTMIN: -40°C; UTYP: Buchse; UVAL: 43045-0200; UVCC_MAX: 600V
X1515 = custom_connector:MA02-2: PIN HEADER
X1601 = custom_connector:MA02-1: PIN HEADER
Z501-Z512 Z601-Z612 = foxBMS_BMS-Slave_12cell:MMSZ4?: MMSZ4xxxT1G Serie - ON Semiconductor Datasheet www <http://www.onsemi.com/pub_link/Collateral/MMSZ4678T1-D.PDF> Datasheet local <file:///C:\Eagle-Datasheet\Dioden\MMSZ4xxxT1G_OnSemiconductor.pdf> Zener Voltage Regulator - 500 mW Rating on FR-4 or FR-5 Board - Wide Zener Reverse Voltage Range - 1.8 V to 43 V - Package Designed for Optimal Automated Board Assembly - Small Package Size for High Density Applications - ESD Rating of Class 3 (> 16 kV) per Human Body Model) - SOD-123 thermosetting molded plastic package Revision Date changed by Changes ------------------------------------------------------------------------------------------ V1.0 01.01.2014 SC Ersterstellung V1.1 06.11.2014 RW Ausfüllen der Attribute; DISTRI_1: Farnell; DISTRI_1-NR: 2463562; DISTRI_1-PREIS: 0,0251 ; HERSTELLER: ON Semiconductor; HERSTELLER-NR: MMSZ4692T1G; MARKING: CX; PDF-LOCAL: file:///C:\Eagle-Datasheet\Dioden\MMSZ4xxxT1G_OnSemiconductor.pdf; SIZE: SOD-123; TEMP: -55 bis +150°C; UCD: 500mW; UIF: 10,0mA; UIR: 10,0uA; UKAT: C; UPV: 500mW; UTERM: Sn; UTOL: 5%; UVAL: MMSZ4692T1G; UVZ: 6.80V

## Net classes
1 DiffPair: width 0.254 mm